# EAGLE schematic Spartan Edge Accelerator Board v1.0 (EAGLE 6.4)
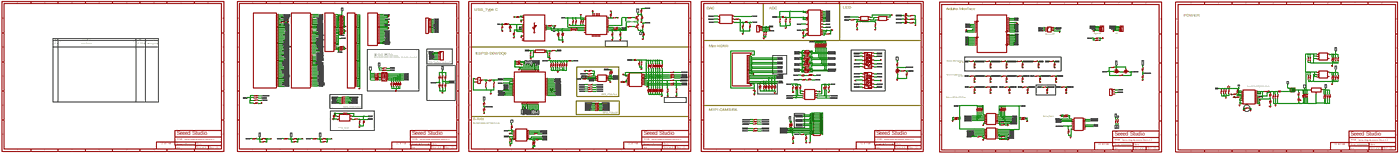
[diagram p0: schematic, sheet 1, overview]
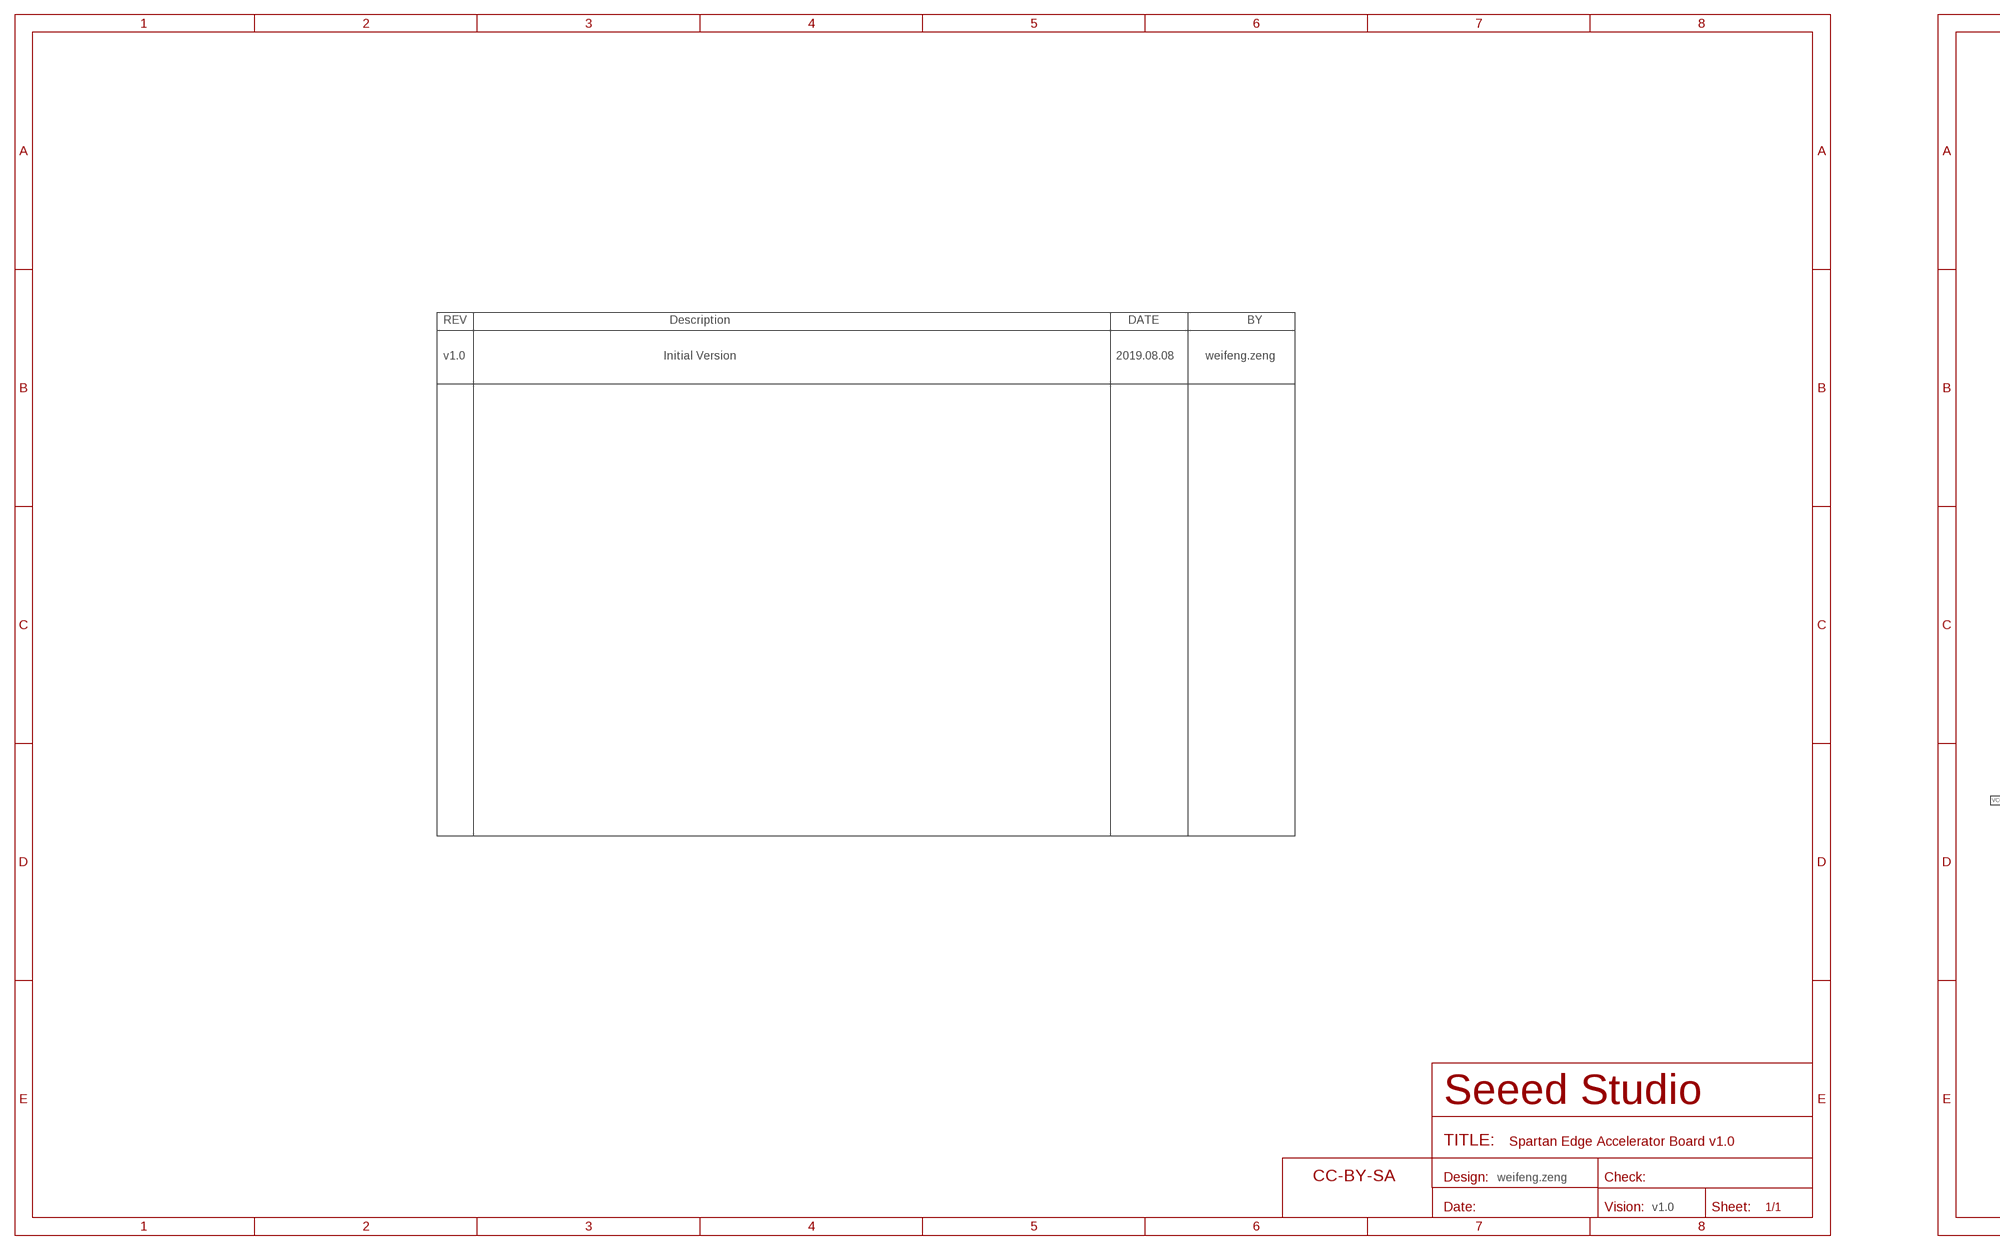
[diagram p1: schematic, sheet 1, part 1 of 7]
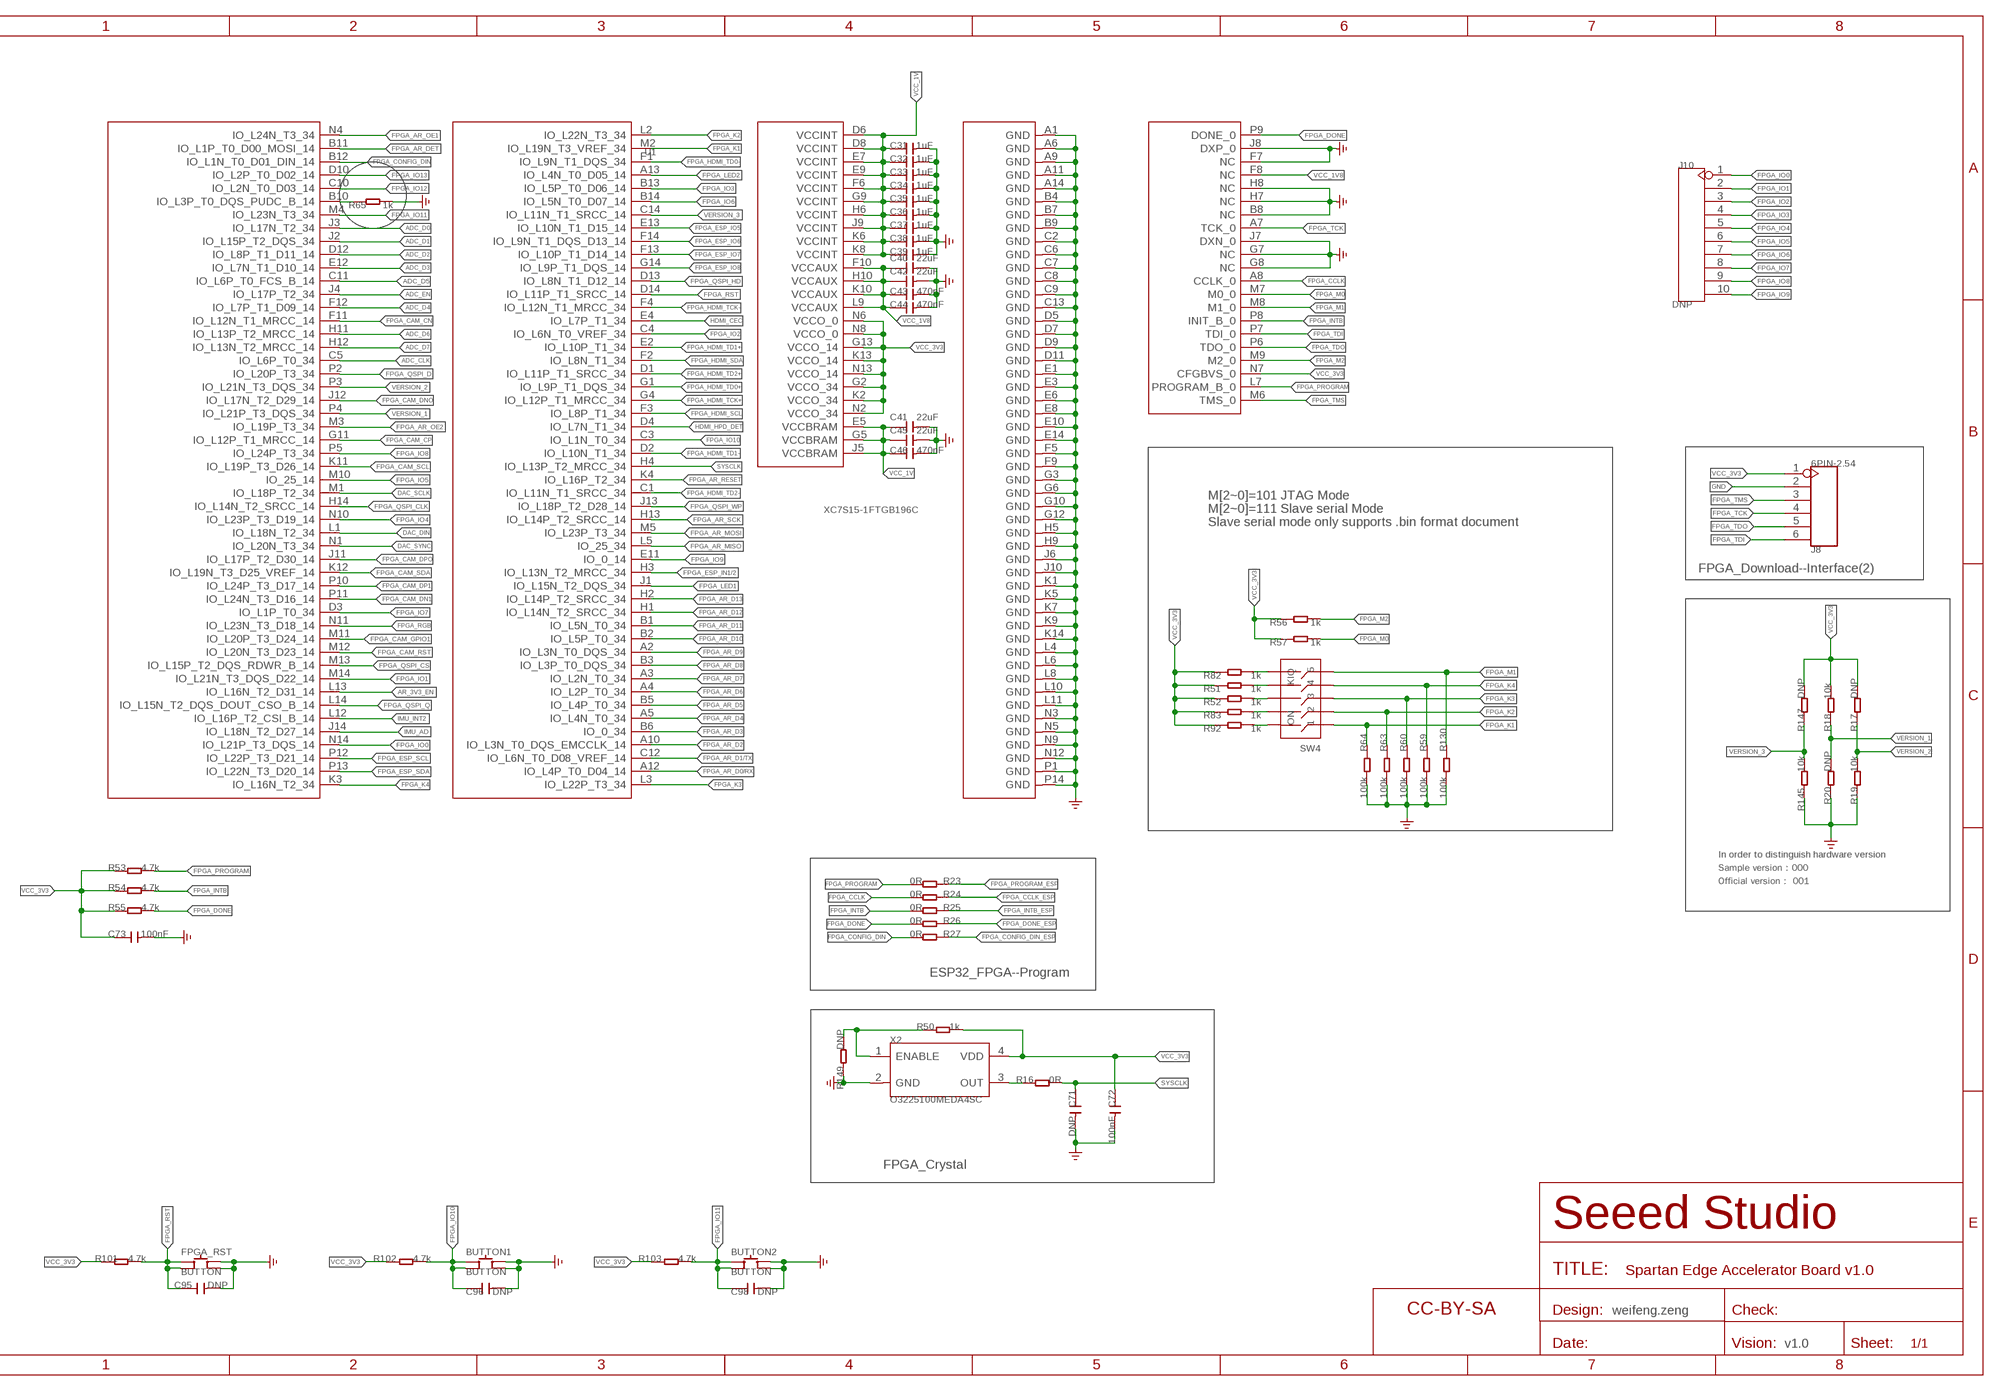
[diagram p2: schematic, sheet 1, part 2 of 7]
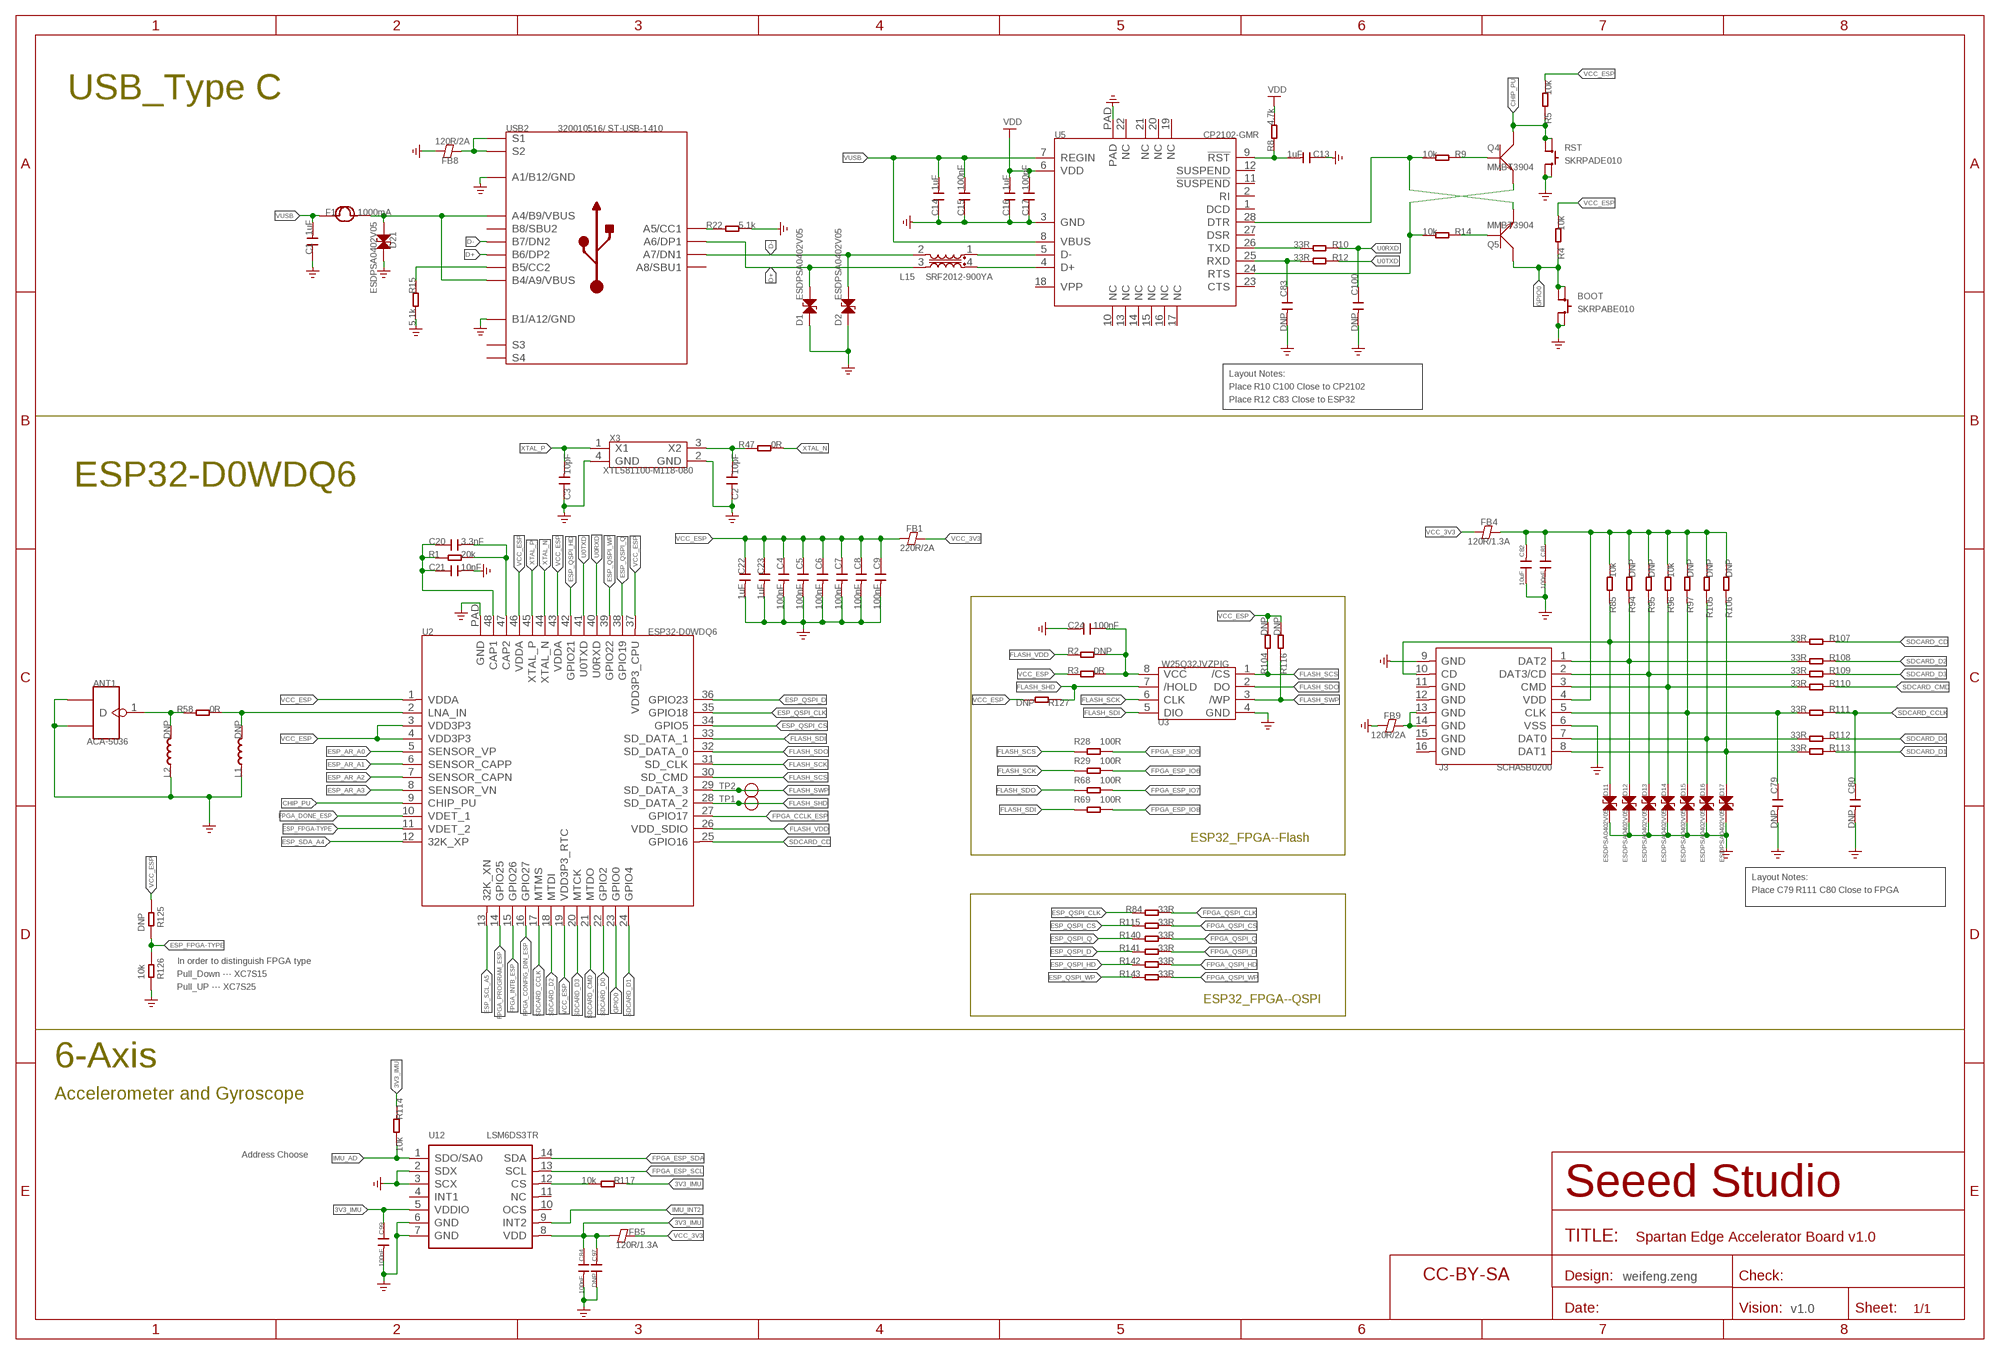
[diagram p3: schematic, sheet 1, part 3 of 7]
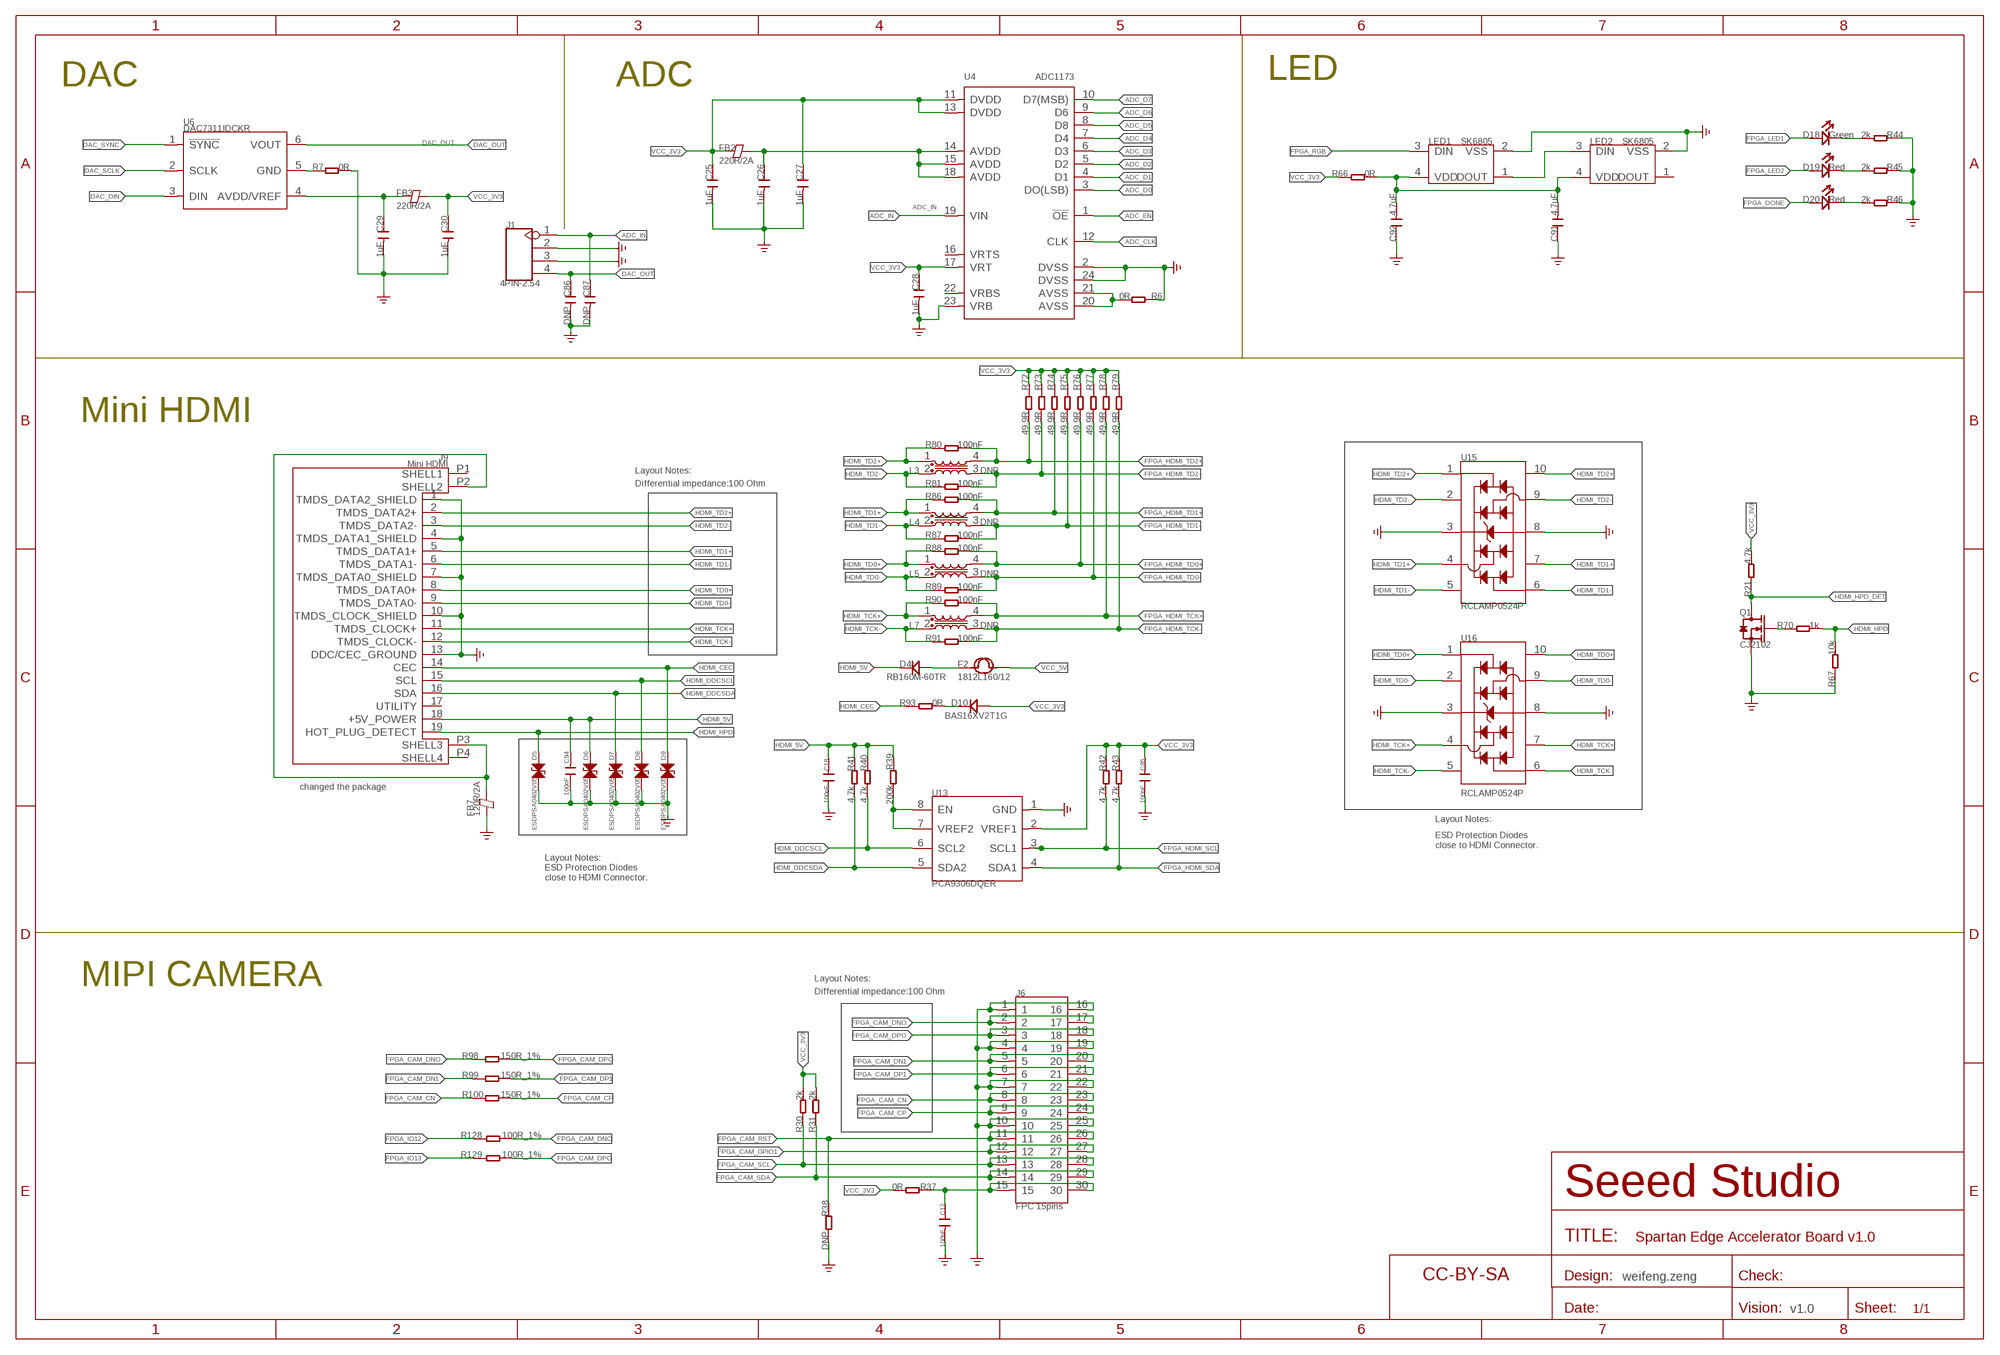
[diagram p4: schematic, sheet 1, part 4 of 7]
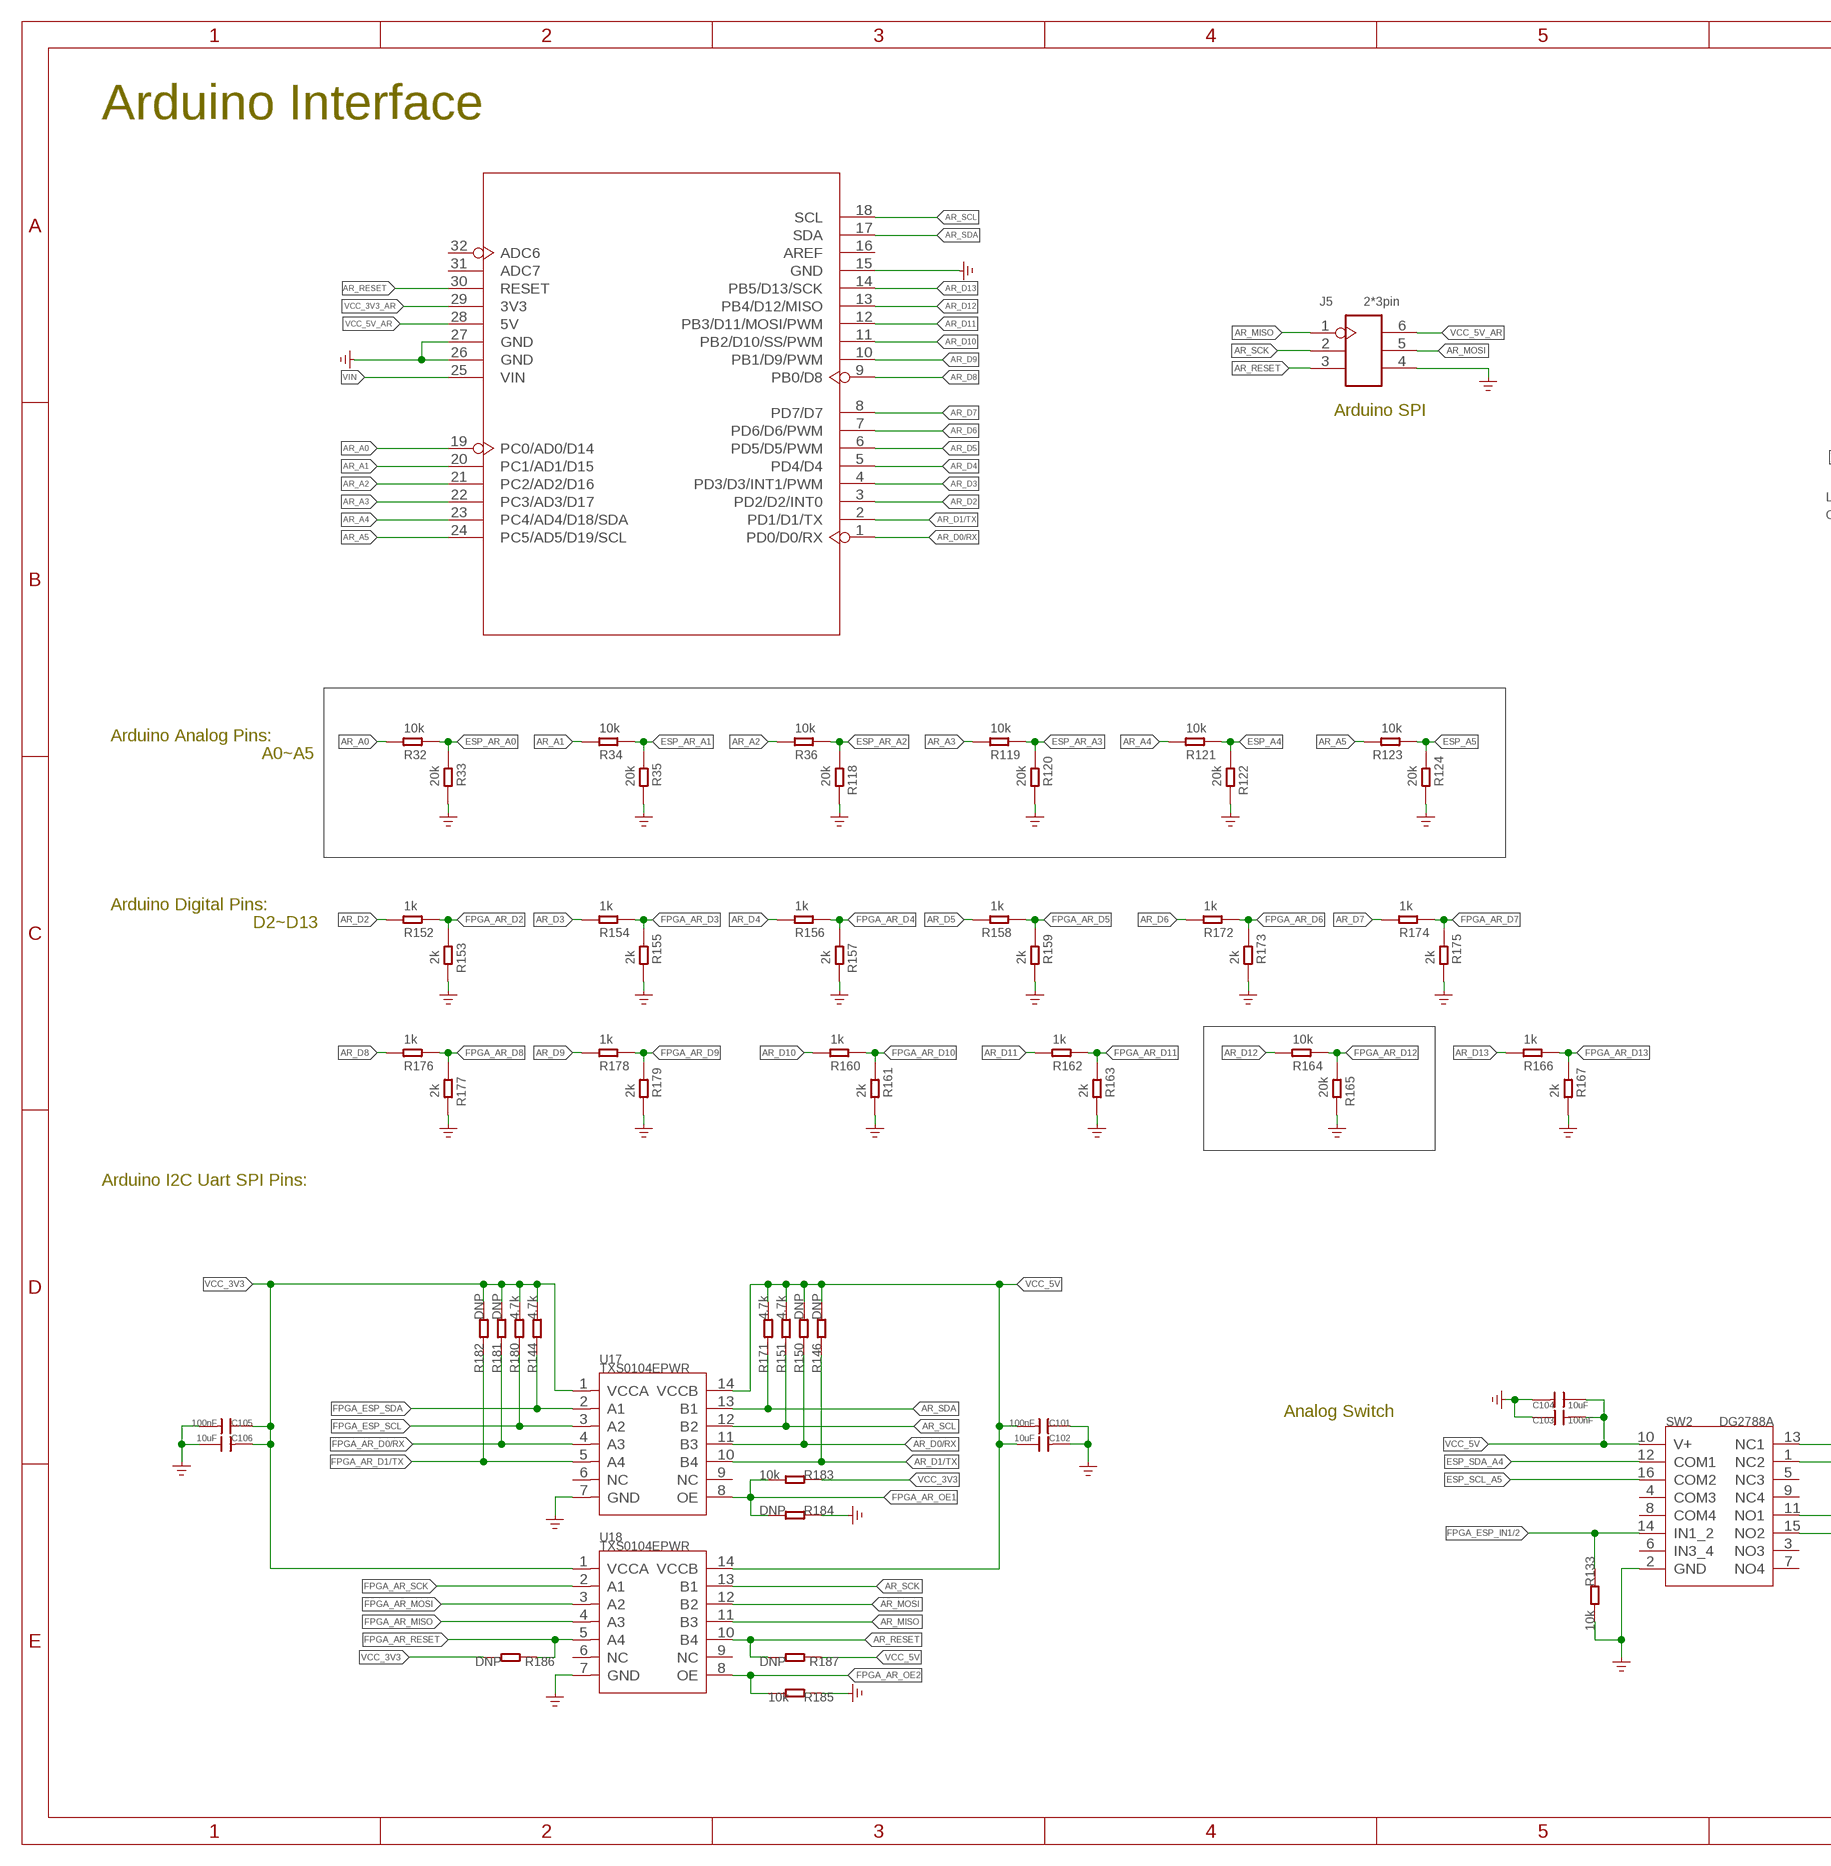
[diagram p5: schematic, sheet 1, part 5 of 7]
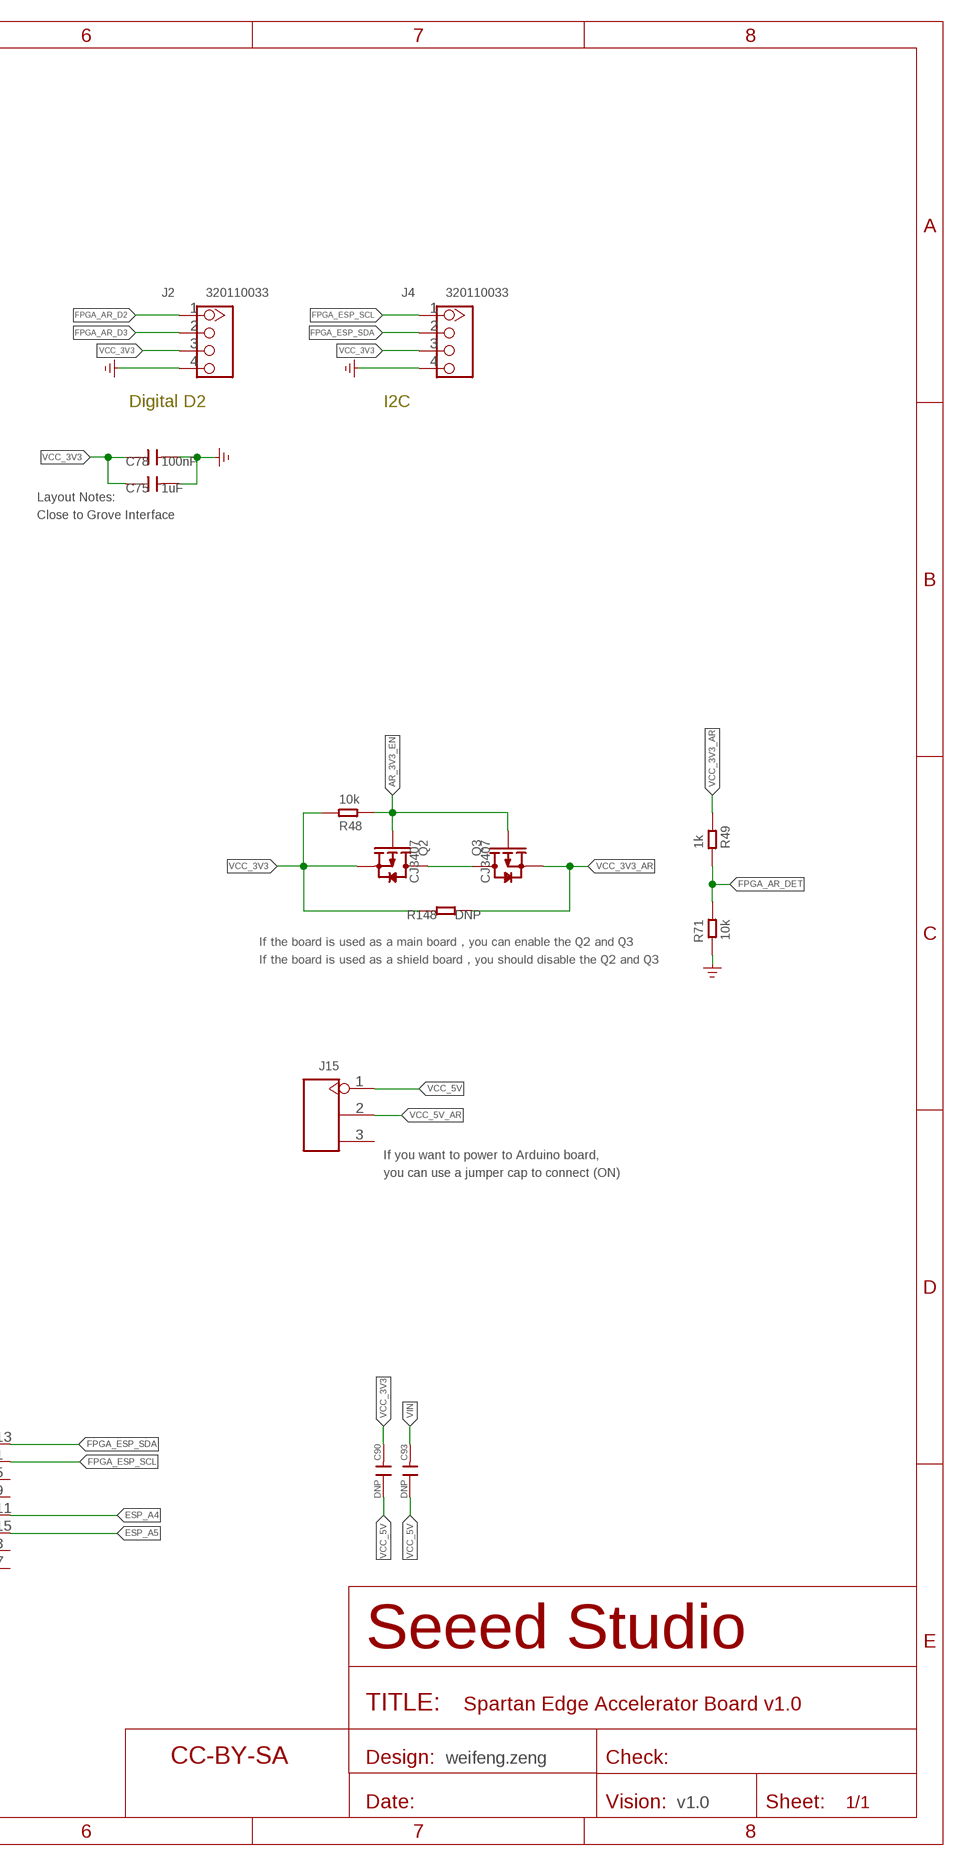
[diagram p6: schematic, sheet 1, part 6 of 7]
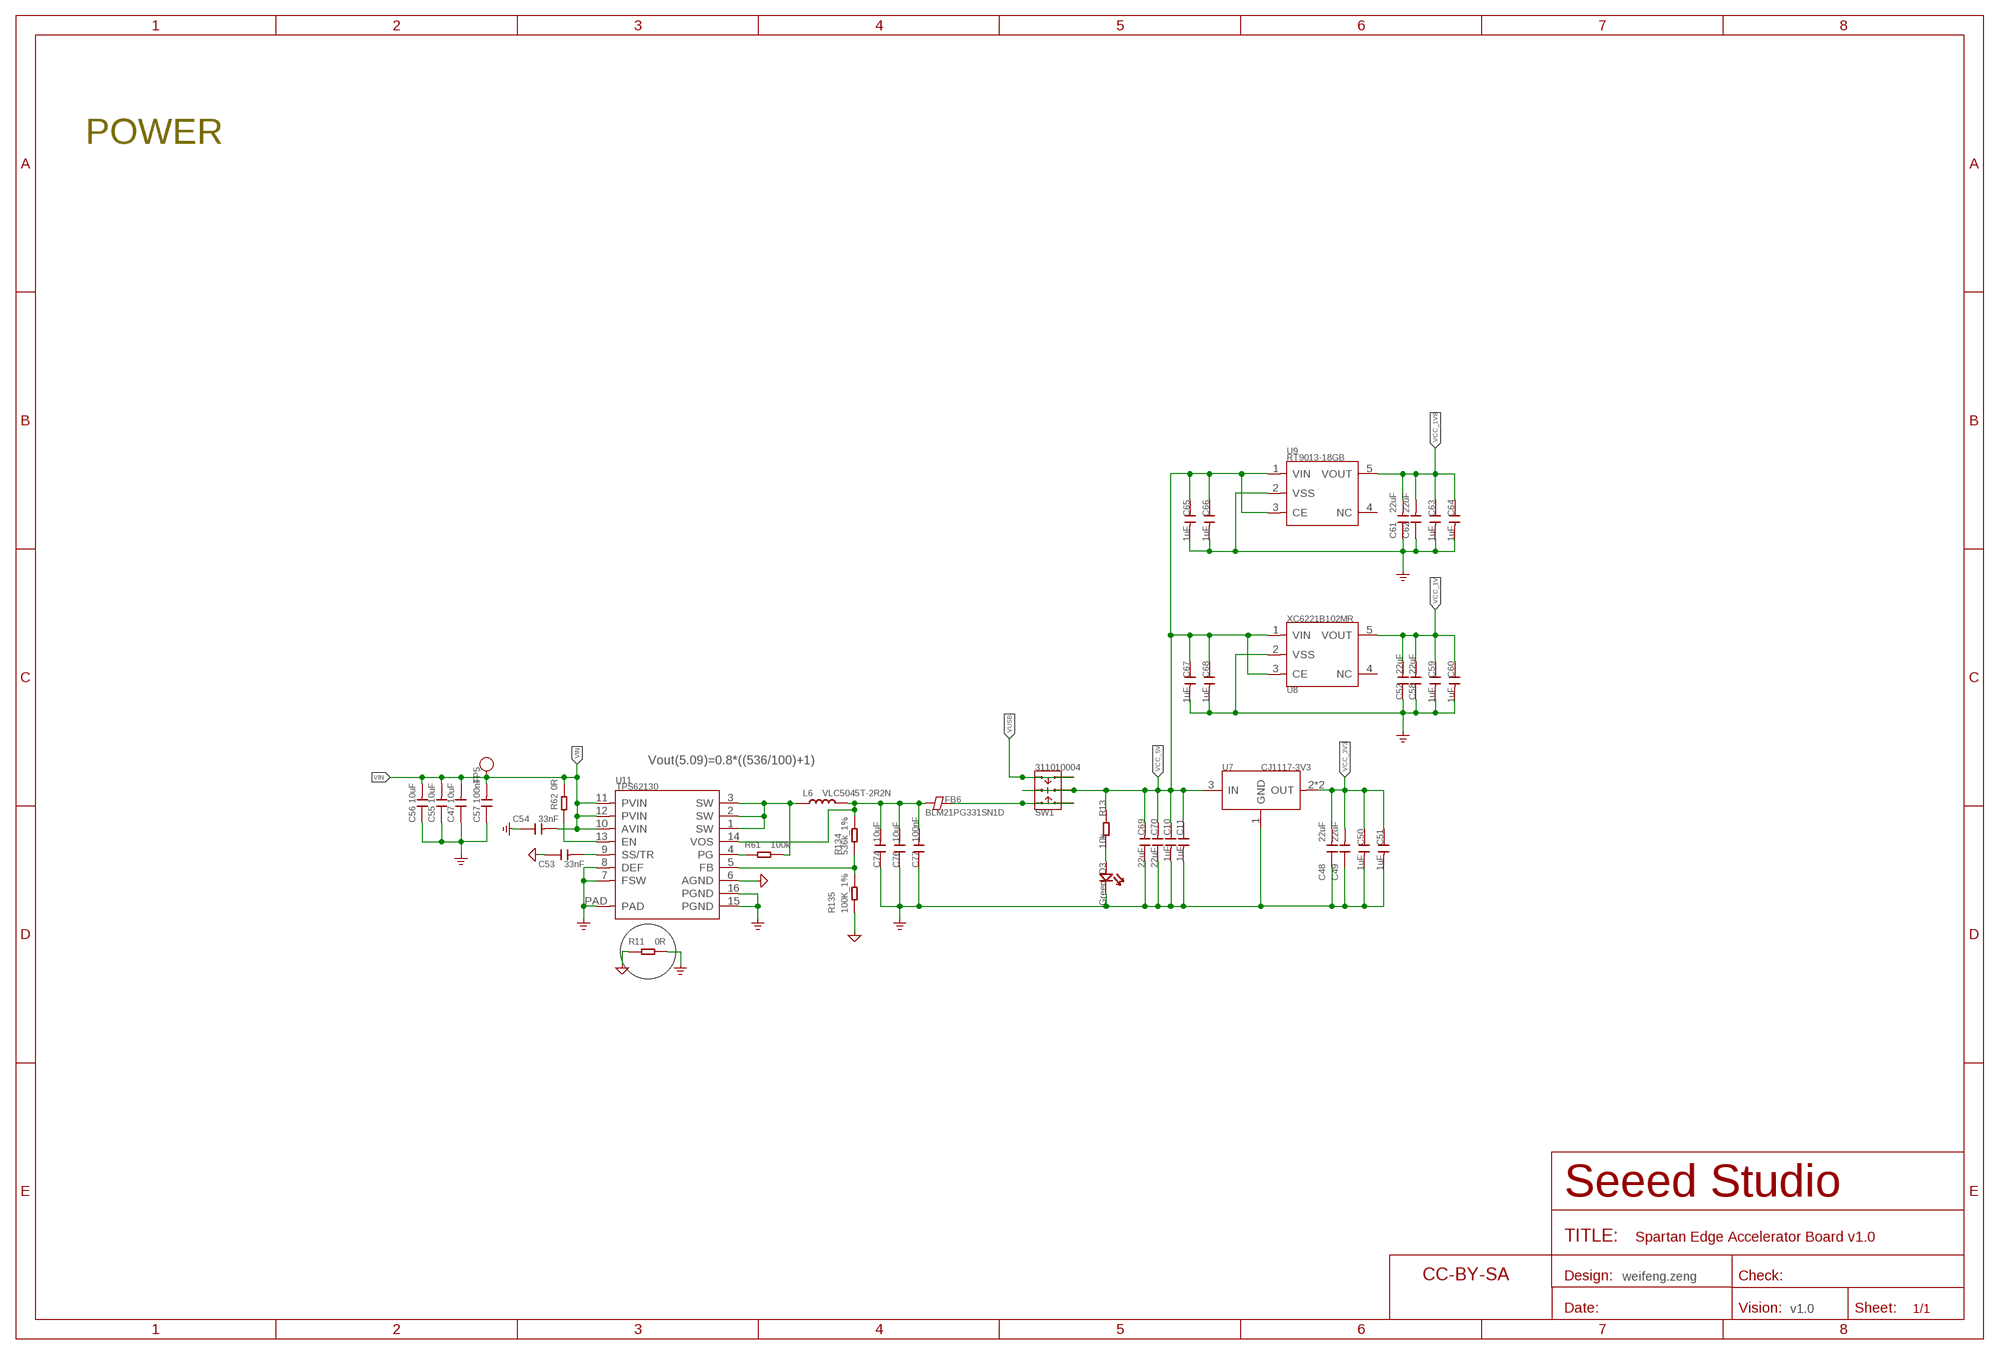
[diagram p7: schematic, sheet 1, part 7 of 7]

## Parts
ANT1  ACA-5036  ANTENNA-ACD5036  [ANT3-SMD-5.2X3.7X0.7MM]
BOOT  SKRPABE010  BUTTON-4P-4.5X3.2  [SW4P-SMD-4.5X3.2X2.5MM]
BUTTON1  BUTTON  BUTTON-4P-4.5X3.2  [SW4P-SMD-4.5X3.2X2.5MM]
BUTTON2  BUTTON  BUTTON-4P-4.5X3.2  [SW4P-SMD-4.5X3.2X2.5MM]
C1  1uF  CAP-0402  [C0402]
C2  10pF  CAP-0402  [C0402]
C3  10pF  CAP-0402  [C0402]
C4  100nF  CAP-0402  [C0402]
C5  100nF  CAP-0402  [C0402]
C6  100nF  CAP-0402  [C0402]
C7  100nF  CAP-0402  [C0402]
C8  100nF  CAP-0402  [C0402]
C9  100nF  CAP-0402  [C0402]
C10  1uF  CAP-0402  [C0402]
C11  1uF  CAP-0402  [C0402]
C12  100nF  CAP-0402  [C0402]
C13  1uF  CAP-0402  [C0402]
C14  1uF  CAP-0402  [C0402]
C15  100nF  CAP-0402  [C0402]
C16  1uF  CAP-0402  [C0402]
C17  100nF  CAP-0402  [C0402]
C18  100nF  CAP-0603  [C0603]
C20  3.3nF  CAP-0402  [C0402]
C21  10nF  CAP-0402  [C0402]
C22  1uF  CAP-0402  [C0402]
C23  1uF  CAP-0402  [C0402]
C24  100nF  CAP-0402  [C0402]
C25  1uF  CAP-0402  [C0402]
C26  1uF  CAP-0402  [C0402]
C27  1uF  CAP-0402  [C0402]
C28  1uF  CAP-0402  [C0402]
C29  1uF  CAP-0402  [C0402]
C30  1uF  CAP-0402  [C0402]
C31  1uF  CAP-0402  [C0402]
C32  1uF  CAP-0402  [C0402]
C33  1uF  CAP-0402  [C0402]
C34  1uF  CAP-0402  [C0402]
C35  1uF  CAP-0402  [C0402]
C36  1uF  CAP-0402  [C0402]
C37  1uF  CAP-0402  [C0402]
C38  1uF  CAP-0402  [C0402]
C39  1uF  CAP-0402  [C0402]
C40  22uF  CAP-1206  [C1206]
C41  22uF  CAP-1206  [C1206]
C42  22uF  CAP-1206  [C1206]
C43  470nF  CAP-0402  [C0402]
C44  470nF  CAP-0402  [C0402]
C45  22uF  CAP-1206  [C1206]
C46  470nF  CAP-0402  [C0402]
C47  10uF  CAP-0805  [C0805]
C48  22uF  CAP-1206  [C1206]
C49  22uF  CAP-1206  [C1206]
C50  1uF  CAP-0402  [C0402]
C51  1uF  CAP-0402  [C0402]
C52  22uF  CAP-1206  [C1206]
C53  33nF  CAP-0603  [C0603]
C54  33nF  CAP-0603  [C0603]
C55  10uF  CAP-0805  [C0805]
C56  10uF  CAP-0805  [C0805]
C57  100nF  CAP-0603  [C0603]
C58  22uF  CAP-1206  [C1206]
C59  1uF  CAP-0402  [C0402]
C60  1uF  CAP-0402  [C0402]
C61  22uF  CAP-1206  [C1206]
C62  22uF  CAP-1206  [C1206]
C63  1uF  CAP-0402  [C0402]
C64  1uF  CAP-0402  [C0402]
C65  1uF  CAP-0402  [C0402]
C66  1uF  CAP-0402  [C0402]
C67  1uF  CAP-0402  [C0402]
C68  1uF  CAP-0402  [C0402]
C69  22uF  CAP-1206  [C1206]
C70  22uF  CAP-1206  [C1206]
C71  DNP  CAP-0402  [C0402]
C72  100nF  CAP-0402  [C0402]
C73  100nF  CAP-0402  [C0402]
C74  10uF  CAP-0805  [C0805]
C75  1uF  CAP-0402  [C0402]
C76  10uF  CAP-0805  [C0805]
C77  100nF  CAP-0603  [C0603]
C78  100nF  CAP-0402  [C0402]
C79  DNP  CAP-0402  [C0402]
C80  DNP  CAP-0402  [C0402]
C81  100nF  CAP-0402  [C0402]
C82  10uF  CAP-0603  [C0603]
C83  DNP  CAP-0402  [C0402]
C84  100nF  CAP-0402  [C0402]
C85  100nF  CAP-0603  [C0603]
C86  DNP  CAP-0402  [C0402]
C87  DNP  CAP-0402  [C0402]
C90  DNP  CAP-0603  [C0603]
C91  4.7uF  CAP-0603  [C0603]
C92  4.7uF  CAP-0603  [C0603]
C93  DNP  CAP-0603  [C0603]
C94  100nF  CAP-0603  [C0603]
C95  DNP  CAP-0402  [C0402]
C96  DNP  CAP-0402  [C0402]
C97  DNP  CAP-0603  [C0603]
C98  DNP  CAP-0402  [C0402]
C99  100nF  CAP-0402  [C0402]
C100  DNP  CAP-0402  [C0402]
C101  100nF  CAP-0402  [C0402]
C102  10uF  CAP-0603  [C0603]
C103  100nF  CAP-0402  [C0402]
C104  10uF  CAP-0603  [C0603]
C105  100nF  CAP-0402  [C0402]
C106  10uF  CAP-0603  [C0603]
D1  ESDPSA0402V05  D-ESD-2P-DOUBLE-0402  [ESD-0402]
D2  ESDPSA0402V05  D-ESD-2P-DOUBLE-0402  [ESD-0402]
D3  Green  LED-0402  [LED-0402]
D4  RB160M-60TR  DIODE'1206'  [SOD-123]
D5  ESDPSA0402V05  D-ESD-2P-DOUBLE-0402  [ESD-0402]
D6  ESDPSA0402V05  D-ESD-2P-DOUBLE-0402  [ESD-0402]
D7  ESDPSA0402V05  D-ESD-2P-DOUBLE-0402  [ESD-0402]
D8  ESDPSA0402V05  D-ESD-2P-DOUBLE-0402  [ESD-0402]
D9  ESDPSA0402V05  D-ESD-2P-DOUBLE-0402  [ESD-0402]
D10  BAS16XV2T1G  DIODE'0603'  [SOD-523]
D11  ESDPSA0402V05  D-ESD-2P-DOUBLE-0402  [ESD-0402]
D12  ESDPSA0402V05  D-ESD-2P-DOUBLE-0402  [ESD-0402]
D13  ESDPSA0402V05  D-ESD-2P-DOUBLE-0402  [ESD-0402]
D14  ESDPSA0402V05  D-ESD-2P-DOUBLE-0402  [ESD-0402]
D15  ESDPSA0402V05  D-ESD-2P-DOUBLE-0402  [ESD-0402]
D16  ESDPSA0402V05  D-ESD-2P-DOUBLE-0402  [ESD-0402]
D17  ESDPSA0402V05  D-ESD-2P-DOUBLE-0402  [ESD-0402]
D18  Green  LED-0402  [LED-0402]
D19  Red  LED-0402  [LED-0402]
D20  Red  LED-0402  [LED-0402]
D21  ESDPSA0402V05  D-ESD-2P-DOUBLE-0402  [ESD-0402]
F1  1000mA  FUSE'1206'  [F1206]
F2  1812L160/12  FUSE'1812'  [F1812]
FB1  220R/2A  FERRITE-BEAD-0603  [F0603]
FB2  220R/2A  FERRITE-BEAD-0603  [F0603]
FB3  220R/2A  FERRITE-BEAD-0603  [F0603]
FB4  120R/1.3A  FERRITE-BEAD-0402  [F0402]
FB5  120R/1.3A  FERRITE-BEAD-0402  [F0402]
FB6  BLM21PG331SN1D  FERRITE-BEAD-0805  [F0805]
FB7  120R/2A  FERRITE-BEAD-0603  [F0603]
FB8  120R/2A  FERRITE-BEAD-0603  [F0603]
FB9  120R/2A  FERRITE-BEAD-0603  [F0603]
FPGA_RST  BUTTON  BUTTON-4P-4.5X3.2  [SW4P-SMD-4.5X3.2X2.5MM]
FR1  SEEEDSTUDIO-OPEN-SCH-FRAME-BIG  [SEEEDSTUDIO-PCB-FRAME]
FR2  SEEEDSTUDIO-OPEN-SCH-FRAME-BIG  [SEEEDSTUDIO-PCB-FRAME]
FR3  SEEEDSTUDIO-OPEN-SCH-FRAME-BIG  [SEEEDSTUDIO-PCB-FRAME]
FR4  SEEEDSTUDIO-OPEN-SCH-FRAME-BIG  [SEEEDSTUDIO-PCB-FRAME]
FR5  SEEEDSTUDIO-OPEN-SCH-FRAME-BIG  [SEEEDSTUDIO-PCB-FRAME]
FR6  SEEEDSTUDIO-OPEN-SCH-FRAME-BIG  [SEEEDSTUDIO-PCB-FRAME]
J1  4PIN-2.54  HEADER-4P-65/35MIL  [H4-2.54]
J2  320110033  GROVE-CONNECTOR-DIP-320110033  [HW4-2.0]
J3  SCHA5B0200  MICRO-SD-CARD-HOLDER-9P-SCHA5B0200-SCHA5B0200  [MICRO-SD9+7P-SMD-15X14.5X1.5]
J4  320110033  GROVE-CONNECTOR-DIP-320110033  [HW4-2.0]
J5  2*3pin  HEADER-2X3P-2.54  [H2X3-2.54]
J6  FPC 15pins  HEADER-2X15P-SMD  [H2X15-SMD-1MM]
J8  6PIN-2.54  HEADER-6P-65/35MIL  [H6-2.54-C65D35MIL]
J9  Mini HDMI  MINI-HDMI-19PIN-SMT-C-TYPE-ST-HD-002B  [HDMI-19+4P-0.4-11.2X7.5MM]
J10  DNP  HEADER-10P-2.54  [H10-2.54]
J15  HEADER-3P-2.54  [H3-2.54]
L1  DNP  INDUCTOR'0402'  [L0402]
L2  DNP  INDUCTOR'0402'  [L0402]
L3  DNP  INDUCTOR-COMMON-MODE-WCM-HDMI  [INT4-0.8-2X1.2MM]
L4  DNP  INDUCTOR-COMMON-MODE-WCM-HDMI  [INT4-0.8-2X1.2MM]
L5  DNP  INDUCTOR-COMMON-MODE-WCM-HDMI  [INT4-0.8-2X1.2MM]
L6  VLC5045T-2R2N  INDUCTOR-4.8X4.8  [INT2-SMD-4.8X4.8X3MM]
L7  DNP  INDUCTOR-COMMON-MODE-WCM-HDMI  [INT4-0.8-2X1.2MM]
L15  SRF2012-900YA  INDUCTOR-COMMON-MODE-SRF2012-900YA  [INT4-0.85-2X1.25X1.2MM]
LED1  SK6805  LED-SK6805-2427  [LED-4P-SMD-2.7X2.4MM]
LED2  SK6805  LED-SK6805-2427  [LED-4P-SMD-2.7X2.4MM]
Q1  CJ2102  MOSFET-N'SI1304BDL'  [SOT-323]
Q2  CJ3407  MOSFET-P'SI2323CDS/SI2305DS<BR>'  [SOT-23]
Q3  CJ3407  MOSFET-P'SI2323CDS/SI2305DS<BR>'  [SOT-23]
Q4  MMBT3904  TRANSISTOR-NPN-SOT23  [SOT-23]
Q5  MMBT3904  TRANSISTOR-NPN-SOT23  [SOT-23]
R1  20k  RES-0402  [R0402]
R2  DNP  RES-0402  [R0402]
R3  0R  RES-0402  [R0402]
R4  10k  RES-0402  [R0402]
R5  10k  RES-0402  [R0402]
R6  0R  RES-0402  [R0402]
R7  0R  RES-0402  [R0402]
R8  4.7k  RES-0402  [R0402]
R9  10k  RES-0402  [R0402]
R10  33R  RES-0402  [R0402]
R11  0R  RES-0603  [R0603]
R12  33R  RES-0402  [R0402]
R13  10k  RES-0402  [R0402]
R14  10k  RES-0402  [R0402]
R15  5.1k  RES-0402  [R0402]
R16  0R  RES-0402  [R0402]
R17  DNP  RES-0402  [R0402]
R18  10k  RES-0402  [R0402]
R19  10k  RES-0402  [R0402]
R20  DNP  RES-0402  [R0402]
R21  4.7k  RES-0402  [R0402]
R22  5.1k  RES-0402  [R0402]
R23  0R  RES-0402  [R0402]
R24  0R  RES-0402  [R0402]
R25  0R  RES-0402  [R0402]
R26  0R  RES-0402  [R0402]
R27  0R  RES-0402  [R0402]
R28  100R  RES-0402  [R0402]
R29  100R  RES-0402  [R0402]
R30  2k  RES-0402  [R0402]
R31  2k  RES-0402  [R0402]
R32  10k  RES-0402  [R0402]
R33  20k  RES-0402  [R0402]
R34  10k  RES-0402  [R0402]
R35  20k  RES-0402  [R0402]
R36  10k  RES-0402  [R0402]
R37  0R  RES-0402  [R0402]
R38  DNP  RES-0402  [R0402]
R39  200k  RES-0402  [R0402]
R40  4.7k  RES-0402  [R0402]
R41  4.7k  RES-0402  [R0402]
R42  4.7k  RES-0402  [R0402]
R43  4.7k  RES-0402  [R0402]
R44  2k  RES-0402  [R0402]
R45  2k  RES-0402  [R0402]
R46  2k  RES-0402  [R0402]
R47  0R  RES-0402  [R0402]
R48  10k  RES-0402  [R0402]
R49  1k  RES-0402  [R0402]
R50  1k  RES-0402  [R0402]
R51  1k  RES-0402  [R0402]
R52  1k  RES-0402  [R0402]
R53  4.7k  RES-0402  [R0402]
R54  4.7k  RES-0402  [R0402]
R55  4.7k  RES-0402  [R0402]
R56  1k  RES-0402  [R0402]
R57  1k  RES-0402  [R0402]
R58  0R  RES-0402  [R0402]
R59  100k  RES-0402  [R0402]
R60  100k  RES-0402  [R0402]
R61  100k  RES-0603  [R0603]
R62  0R  RES-0603  [R0603]
R63  100k  RES-0402  [R0402]
R64  100k  RES-0402  [R0402]
R65  1k  RES-0402  [R0402]
R66  0R  RES-0402  [R0402]
R67  10k  RES-0402  [R0402]
R68  100R  RES-0402  [R0402]
R69  100R  RES-0402  [R0402]
R70  1k  RES-0402  [R0402]
R71  10k  RES-0402  [R0402]
R72  49.9R  RES-0402  [R0402]
R73  49.9R  RES-0402  [R0402]
R74  49.9R  RES-0402  [R0402]
R75  49.9R  RES-0402  [R0402]
R76  49.9R  RES-0402  [R0402]
R77  49.9R  RES-0402  [R0402]
R78  49.9R  RES-0402  [R0402]
R79  49.9R  RES-0402  [R0402]
R80  100nF  RES-0603  [R0603]
R81  100nF  RES-0603  [R0603]
R82  1k  RES-0402  [R0402]
R83  1k  RES-0402  [R0402]
R84  33R  RES-0402  [R0402]
R85  10k  RES-0402  [R0402]
R86  100nF  RES-0603  [R0603]
R87  100nF  RES-0603  [R0603]
R88  100nF  RES-0603  [R0603]
R89  100nF  RES-0603  [R0603]
R90  100nF  RES-0603  [R0603]
R91  100nF  RES-0603  [R0603]
R92  1k  RES-0402  [R0402]
R93  0R  RES-0402  [R0402]
R94  DNP  RES-0402  [R0402]
R95  DNP  RES-0402  [R0402]
R96  10k  RES-0402  [R0402]
R97  DNP  RES-0402  [R0402]
R98  150R_1%  RES-0402  [R0402]
R99  150R_1%  RES-0402  [R0402]
R100  150R_1%  RES-0402  [R0402]
R101  4.7k  RES-0402  [R0402]
R102  4.7k  RES-0402  [R0402]
R103  4.7k  RES-0402  [R0402]
R104  DNP  RES-0402  [R0402]
R105  DNP  RES-0402  [R0402]
R106  DNP  RES-0402  [R0402]
R107  33R  RES-0402  [R0402]
R108  33R  RES-0402  [R0402]
R109  33R  RES-0402  [R0402]
R110  33R  RES-0402  [R0402]
R111  33R  RES-0402  [R0402]
R112  33R  RES-0402  [R0402]
R113  33R  RES-0402  [R0402]
R114  10k  RES-0402  [R0402]
R115  33R  RES-0402  [R0402]
R116  DNP  RES-0402  [R0402]
R117  10k  RES-0402  [R0402]
R118  20k  RES-0402  [R0402]
R119  10k  RES-0402  [R0402]
R120  20k  RES-0402  [R0402]
R121  10k  RES-0402  [R0402]
R122  20k  RES-0402  [R0402]
R123  10k  RES-0402  [R0402]
R124  20k  RES-0402  [R0402]
R125  DNP  RES-0402  [R0402]
R126  10k  RES-0402  [R0402]
R127  DNP  RES-0402  [R0402]
R128  100R_1%  RES-0402  [R0402]
R129  100R_1%  RES-0402  [R0402]
R130  100k  RES-0402  [R0402]
R133  10k  RES-0402  [R0402]
R134  536k_1%  RES-0603  [R0603]
R135  100K_1%  RES-0603  [R0603]
R140  33R  RES-0402  [R0402]
R141  33R  RES-0402  [R0402]
R142  33R  RES-0402  [R0402]
R143  33R  RES-0402  [R0402]
R144  4.7k  RES-0402  [R0402]
R145  10k  RES-0402  [R0402]
R146  DNP  RES-0402  [R0402]
R147  DNP  RES-0402  [R0402]
R148  DNP  RES-1206  [R1206]
R149  DNP  RES-0402  [R0402]
R150  DNP  RES-0402  [R0402]
R151  4.7k  RES-0402  [R0402]
R152  1k  RES-0402  [R0402]
R153  2k  RES-0402  [R0402]
R154  1k  RES-0402  [R0402]
R155  2k  RES-0402  [R0402]
R156  1k  RES-0402  [R0402]
R157  2k  RES-0402  [R0402]
R158  1k  RES-0402  [R0402]
R159  2k  RES-0402  [R0402]
R160  1k  RES-0402  [R0402]
R161  2k  RES-0402  [R0402]
R162  1k  RES-0402  [R0402]
R163  2k  RES-0402  [R0402]
R164  10k  RES-0402  [R0402]
R165  20k  RES-0402  [R0402]
R166  1k  RES-0402  [R0402]
R167  2k  RES-0402  [R0402]
R171  4.7k  RES-0402  [R0402]
R172  1k  RES-0402  [R0402]
R173  2k  RES-0402  [R0402]
R174  1k  RES-0402  [R0402]
R175  2k  RES-0402  [R0402]
R176  1k  RES-0402  [R0402]
R177  2k  RES-0402  [R0402]
R178  1k  RES-0402  [R0402]
R179  2k  RES-0402  [R0402]
R180  4.7k  RES-0402  [R0402]
R181  DNP  RES-0402  [R0402]
R182  DNP  RES-0402  [R0402]
R183  10k  RES-0402  [R0402]
R184  DNP  RES-0402  [R0402]
R185  10k  RES-0402  [R0402]
R186  DNP  RES-0402  [R0402]
R187  DNP  RES-0402  [R0402]
RST  SKRPADE010  BUTTON-4P-4.5X3.2  [SW4P-SMD-4.5X3.2X2.5MM]
SW1  311010004  SWITCH-2CH-6P-311010004  [SW6-2.54-9.0X3.5X3.2+2.0MM]
SW2  DG2788A  SWITCH-DG2788A  [MINI-QFN16-0.4-2.6X1.8X0.55MM]
SW4  SWITCH-5BIT-DSHP05TSGER  [10P-SMD-7.95X5.4X2.3MM]
TP1  TEST-POINT-35  [TP_3535]
TP2  TEST-POINT-35  [TP_3535]
TP5  TEST-POINT'4545'  [TP-D45MIL]
U1  XC7S15-1FTGB196C  XC7S15  [FTGB196-1.0-15X15X1.46MM]
U2  ESP32-D0WDQ6  MCU-ESP32-DD0WDQ6  [QFN48G-0.4-6X6MM]
U3  W25Q32JVZPIG  FLASH-W25X80-5X4-SN  [SOIC8-1.27-5X4MM]
U4  ADC1173  CONVERTER-ADC1173  [TSSOP24-0.65-7.8X4.4MM]
U5  CP2102-GMR  TRANSFER_CP2102_9  [QFN28]
U6  DAC7311IDCKR  CONVERTER-DAC7311  [SC-70-6]
U7  CJ1117-3V3  PMIC-CJ1117S  [SOT-223]
U8  XC6221B102MR  PMIC-LDO-XC6210  [SOT-23-5]
U9  RT9013-18GB  PMIC-LDO-XC6210  [SOT-23-5]
U10  Arduino pins  ARDUINO-32P  [ARDUINO-32P]
U11  TPS62130  PMIC-TPS62140  [VQFN16-0.5-3X3X1MM]
U12  LSM6DS3TR  SENSOR-LSM6DS3DOT_INDICATION  [LGA14L_DOT_INDICATOR]
U13  PCA9306DQER  TRANSLATOR-PCA9306DQER  [X2SON8-0.35-1.4X1X0.37MM]
U15  RCLAMP0524P  ESD-RCLAMP0524P  [ESD10P-0.5-2.5X1X0.58MM]
U16  RCLAMP0524P  ESD-RCLAMP0524P  [ESD10P-0.5-2.5X1X0.58MM]
U17  TXS0104EPWR  TRANSLATOR-TXS0104E  [TSSOP14-0.65-5X4.4MM]
U18  TXS0104EPWR  TRANSLATOR-TXS0104E  [TSSOP14-0.65-5X4.4MM]
USB2  320010516/ ST-USB-1410  USB2.0-TYPE-C  [USB2.0-TYPE-C]
X2  O3225100MEDA4SC  CRYSTAL-OSCILLATOR-3225  [X4-SMD-3.2X2.5X1MM]
X3  XTL581100-M118-080  CRYSTAL-4P-2520  [X4-SMD-2.5X2.0X1.0MM]

## Nets
3V3_IMU: C84.1 C97.2 C99.1 FB5.2 R114.2 R117.2 U12.5(VDDIO) U12.8(VDD)
ADC_CLK: U1.C5(IO_L6P_T0_34) U4.12(CLK)
ADC_D0: U1.J3(IO_L17N_T2_34) U4.3(DO(LSB))
ADC_D1: U1.J2(IO_L15P_T2_DQS_34) U4.4(D1)
ADC_D2: U1.D12(IO_L8P_T1_D11_14) U4.5(D2)
ADC_D3: U1.E12(IO_L7N_T1_D10_14) U4.6(D3)
ADC_D4: U1.F12(IO_L7P_T1_D09_14) U4.7(D4)
ADC_D5: U1.C11(IO_L6P_T0_FCS_B_14) U4.8(D8)
ADC_D6: U1.H11(IO_L13P_T2_MRCC_14) U4.9(D6)
ADC_D7: U1.H12(IO_L13N_T2_MRCC_14) U4.10(D7(MSB))
ADC_EN: U1.J4(IO_L17P_T2_34) U4.1(!OE)
ADC_IN: C87.1 J1.1 U4.19(VIN)
AGND: C53.1 R11.1 R135.2 U11.6(AGND) ; supply symbol labelled GND_SIGNAL
AR_3V3_EN: Q2.1(G) Q3.1(G) R48.1 U1.L13(IO_L16N_T2_D31_14)
AR_A0: R32.2 U10.19(PC0/AD0/D14)
AR_A1: R34.2 U10.20(PC1/AD1/D15)
AR_A2: R36.2 U10.21(PC2/AD2/D16)
AR_A3: R119.2 U10.22(PC3/AD3/D17)
AR_A4: R121.2 U10.23(PC4/AD4/D18/SDA)
AR_A5: R123.2 U10.24(PC5/AD5/D19/SCL)
AR_D0/RX: R150.1 U10.1(PD0/D0/RX) U17.11(B3)
AR_D1/TX: R146.1 U10.2(PD1/D1/TX) U17.10(B4)
AR_D2: R152.2 U10.3(PD2/D2/INT0)
AR_D3: R154.2 U10.4(PD3/D3/INT1/PWM)
AR_D4: R156.2 U10.5(PD4/D4)
AR_D5: R158.2 U10.6(PD5/D5/PWM)
AR_D6: R172.2 U10.7(PD6/D6/PWM)
AR_D7: R174.2 U10.8(PD7/D7)
AR_D8: R176.2 U10.9(PB0/D8)
AR_D9: R178.2 U10.10(PB1/D9/PWM)
AR_D10: R160.2 U10.11(PB2/D10/SS/PWM)
AR_D11: R162.2 U10.12(PB3/D11/MOSI/PWM)
AR_D12: R164.2 U10.13(PB4/D12/MISO)
AR_D13: R166.2 U10.14(PB5/D13/SCK)
AR_MISO: J5.1 U18.11(B3)
AR_MOSI: J5.5 U18.12(B2)
AR_RESET: J5.3 R187.2 U10.30(RESET) U18.10(B4)
AR_SCK: J5.2 U18.13(B1)
AR_SCL: R151.1 U10.18(SCL) U17.12(B2)
AR_SDA: R171.1 U10.17(SDA) U17.13(B1)
CHIP_PU: Q4.3(C) R5.1 RST.1(A0) RST.2(A1) U2.9(CHIP_PU)
D+: D1.2 L15.3 USB2.A6(A6/DP1) USB2.B6(B6/DP2)
D-: D2.2 L15.2 USB2.A7(A7/DN1) USB2.B7(B7/DN2)
DAC_DIN: U1.L1(IO_L18N_T2_34) U6.3(DIN)
DAC_OUT: C86.1 J1.4 U6.6(VOUT)
DAC_SCLK: U1.M1(IO_L18P_T2_34) U6.2(SCLK)
DAC_SYNC: U1.N1(IO_L20N_T3_34) U6.1(!SYNC)
ESP_A4: R121.1 R122.1 SW2.11(NO1)
ESP_A5: R123.1 R124.1 SW2.15(NO2)
ESP_AR_A0: R32.1 R33.1 U2.5(SENSOR_VP)
ESP_AR_A1: R34.1 R35.1 U2.6(SENSOR_CAPP)
ESP_AR_A2: R36.1 R118.1 U2.7(SENSOR_CAPN)
ESP_AR_A3: R119.1 R120.1 U2.8(SENSOR_VN)
ESP_FPGA-TYPE: R125.1 R126.2 U2.11(VDET_2)
ESP_QSPI_CLK: R84.2 U2.35(GPIO18)
ESP_QSPI_CS: R115.2 U2.34(GPIO5)
ESP_QSPI_D: R141.2 U2.36(GPIO23)
ESP_QSPI_HD: R142.2 U2.42(GPIO21)
ESP_QSPI_Q: R140.2 U2.38(GPIO19)
ESP_QSPI_WP: R143.2 U2.39(GPIO22)
ESP_SCL_A5: SW2.16(COM2) U2.13(32K_XN)
ESP_SDA_A4: SW2.12(COM1) U2.12(32K_XP)
FLASH_SCK: R29.2 U2.31(SD_CLK) U3.6(CLK)
FLASH_SCS: R28.2 R104.2 U2.30(SD_CMD) U3.1(/CS)
FLASH_SDI: R69.2 U2.33(SD_DATA_1) U3.5(DIO)
FLASH_SDO: R68.2 U2.32(SD_DATA_0) U3.2(DO)
FLASH_SHD: R127.2 TP1.T U2.28(SD_DATA_2) U3.7(/HOLD)
FLASH_SWP: R116.2 TP2.T U2.29(SD_DATA_3) U3.3(/WP)
FLASH_VDD: R2.2 U2.26(VDD_SDIO)
FPGA_AR_D0/RX: R181.1 U1.A12(IO_L4P_T0_D04_14) U17.4(A3)
FPGA_AR_D1/TX: R182.1 U1.C12(IO_L6N_T0_D08_VREF_14) U17.5(A4)
FPGA_AR_D2: J2.1 R152.1 R153.1 U1.A10(IO_L3N_T0_DQS_EMCCLK_14)
FPGA_AR_D3: J2.2 R154.1 R155.1 U1.B6(IO_0_34)
FPGA_AR_D4: R156.1 R157.1 U1.A5(IO_L4N_T0_34)
FPGA_AR_D5: R158.1 R159.1 U1.B5(IO_L4P_T0_34)
FPGA_AR_D6: R172.1 R173.1 U1.A4(IO_L2P_T0_34)
FPGA_AR_D7: R174.1 R175.1 U1.A3(IO_L2N_T0_34)
FPGA_AR_D8: R176.1 R177.1 U1.B3(IO_L3P_T0_DQS_34)
FPGA_AR_D9: R178.1 R179.1 U1.A2(IO_L3N_T0_DQS_34)
FPGA_AR_D10: R160.1 R161.1 U1.B2(IO_L5P_T0_34)
FPGA_AR_D11: R162.1 R163.1 U1.B1(IO_L5N_T0_34)
FPGA_AR_D12: R164.1 R165.1 U1.H1(IO_L14N_T2_SRCC_34)
FPGA_AR_D13: R166.1 R167.1 U1.H2(IO_L14P_T2_SRCC_34)
FPGA_AR_DET: R49.2 R71.2 U1.B11(IO_L1P_T0_D00_MOSI_14)
FPGA_AR_MISO: U1.L5(IO_25_34) U18.4(A3)
FPGA_AR_MOSI: U1.M5(IO_L23P_T3_34) U18.3(A2)
FPGA_AR_OE1: R183.2 R184.2 U1.N4(IO_L24N_T3_34) U17.8(OE)
FPGA_AR_OE2: R185.2 U1.M3(IO_L19P_T3_34) U18.8(OE)
FPGA_AR_RESET: R186.1 U1.K4(IO_L16P_T2_34) U18.5(A4)
FPGA_AR_SCK: U1.H13(IO_L14P_T2_SRCC_14) U18.2(A1)
FPGA_CAM_CN: J6.8 J6.23 R100.1 U1.F11(IO_L12N_T1_MRCC_14)
FPGA_CAM_CP: J6.9 J6.24 R100.2 U1.G11(IO_L12P_T1_MRCC_14)
FPGA_CAM_DN1: J6.5 J6.20 R99.1 U1.P11(IO_L24N_T3_D16_14)
FPGA_CAM_DNO: J6.2 J6.17 R98.1 R128.1 U1.J12(IO_L17N_T2_D29_14)
FPGA_CAM_DP1: J6.6 J6.21 R99.2 U1.P10(IO_L24P_T3_D17_14)
FPGA_CAM_DPO: J6.3 J6.18 R98.2 R129.1 U1.J11(IO_L17P_T2_D30_14)
FPGA_CAM_GPIO1: J6.12 J6.27 U1.M11(IO_L20P_T3_D24_14)
FPGA_CAM_RST: J6.11 J6.26 R38.1 U1.M12(IO_L20N_T3_D23_14)
FPGA_CAM_SCL: J6.13 J6.28 R30.1 U1.K11(IO_L19P_T3_D26_14)
FPGA_CAM_SDA: J6.14 J6.29 R31.1 U1.K12(IO_L19N_T3_D25_VREF_14)
FPGA_CCLK: R24.2 U1.A8(CCLK_0)
FPGA_CCLK_ESP: R24.1 U2.27(GPIO17)
FPGA_CONFIG_DIN: R27.2 U1.B12(IO_L1N_T0_D01_DIN_14)
FPGA_CONFIG_DIN_ESP: R27.1 U2.16(GPIO27)
FPGA_DONE: D20.+ R26.2 R55.2 U1.P9(DONE_0)
FPGA_DONE_ESP: R26.1 U2.10(VDET_1)
FPGA_ESP_IN1/2: R133.1 SW2.14(IN1_2) U1.H3(IO_L13N_T2_MRCC_34)
FPGA_ESP_IO5: R28.1 U1.E13(IO_L10N_T1_D15_14)
FPGA_ESP_IO6: R29.1 U1.F14(IO_L9N_T1_DQS_D13_14)
FPGA_ESP_IO7: R68.1 U1.F13(IO_L10P_T1_D14_14)
FPGA_ESP_IO8: R69.1 U1.G14(IO_L9P_T1_DQS_14)
FPGA_ESP_SCL: J4.1 R180.1 SW2.1(NC2) U1.P12(IO_L22P_T3_D21_14) U12.13(SCL) U17.3(A2)
FPGA_ESP_SDA: J4.2 R144.1 SW2.13(NC1) U1.P13(IO_L22N_T3_D20_14) U12.14(SDA) U17.2(A1)
FPGA_HDMI_SCL: R42.2 U1.F3(IO_L8P_T1_34) U13.3(SCL1)
FPGA_HDMI_SDA: R43.2 U1.F2(IO_L8N_T1_34) U13.4(SDA1)
FPGA_HDMI_TCK+: L7.4 R78.2 R90.2 U1.G4(IO_L12P_T1_MRCC_34)
FPGA_HDMI_TCK-: L7.3 R79.2 R91.2 U1.F4(IO_L12N_T1_MRCC_34)
FPGA_HDMI_TD0+: L5.4 R76.2 R88.2 U1.G1(IO_L9P_T1_DQS_34)
FPGA_HDMI_TD0-: L5.3 R77.2 R89.2 U1.F1(IO_L9N_T1_DQS_34)
FPGA_HDMI_TD1+: L4.4 R74.2 R86.2 U1.E2(IO_L10P_T1_34)
FPGA_HDMI_TD1-: L4.3 R75.2 R87.2 U1.D2(IO_L10N_T1_34)
FPGA_HDMI_TD2+: L3.4 R72.2 R80.2 U1.D1(IO_L11P_T1_SRCC_34)
FPGA_HDMI_TD2-: L3.3 R73.2 R81.2 U1.C1(IO_L11N_T1_SRCC_34)
FPGA_INTB: R25.2 R54.2 U1.P8(INIT_B_0)
FPGA_INTB_ESP: R25.1 U2.15(GPIO26)
FPGA_IO0: J10.1 U1.N14(IO_L21P_T3_DQS_14)
FPGA_IO1: J10.2 U1.M14(IO_L21N_T3_DQS_D22_14)
FPGA_IO2: J10.3 U1.C4(IO_L6N_T0_VREF_34)
FPGA_IO3: J10.4 U1.B13(IO_L5P_T0_D06_14)
FPGA_IO4: J10.5 U1.N10(IO_L23P_T3_D19_14)
FPGA_IO5: J10.6 U1.M10(IO_25_14)
FPGA_IO6: J10.7 U1.B14(IO_L5N_T0_D07_14)
FPGA_IO7: J10.8 U1.D3(IO_L1P_T0_34)
FPGA_IO8: J10.9 U1.P5(IO_L24P_T3_34)
FPGA_IO9: J10.10 U1.E11(IO_0_14)
FPGA_IO10: BUTTON1.1(A0) BUTTON1.2(A1) C96.1 R102.2 U1.C3(IO_L1N_T0_34)
FPGA_IO11: BUTTON2.1(A0) BUTTON2.2(A1) C98.1 R103.2 U1.M4(IO_L23N_T3_34)
FPGA_IO12: R128.2 U1.C10(IO_L2N_T0_D03_14)
FPGA_IO13: R129.2 U1.D10(IO_L2P_T0_D02_14)
FPGA_K1: R64.1 SW4.1 U1.M2(IO_L19N_T3_VREF_34)
FPGA_K2: R63.1 SW4.2 U1.L2(IO_L22N_T3_34)
FPGA_K3: R60.1 SW4.3 U1.L3(IO_L22P_T3_34)
FPGA_K4: R59.1 SW4.4 U1.K3(IO_L16N_T2_34)
FPGA_LED1: D18.+ U1.J1(IO_L15N_T2_DQS_34)
FPGA_LED2: D19.+ U1.A13(IO_L4N_T0_D05_14)
FPGA_M0: R57.2 U1.M7(M0_0)
FPGA_M1: R130.1 SW4.5 U1.M8(M1_0)
FPGA_M2: R56.2 U1.M9(M2_0)
FPGA_PROGRAM: R23.2 R53.2 U1.L7(PROGRAM_B_0)
FPGA_PROGRAM_ESP: R23.1 U2.14(GPIO25)
FPGA_QSPI_CLK: R84.1 U1.H14(IO_L14N_T2_SRCC_14)
FPGA_QSPI_CS: R115.1 U1.M13(IO_L15P_T2_DQS_RDWR_B_14)
FPGA_QSPI_D: R141.1 U1.P2(IO_L20P_T3_34)
FPGA_QSPI_HD: R142.1 U1.D13(IO_L8N_T1_D12_14)
FPGA_QSPI_Q: R140.1 U1.L14(IO_L15N_T2_DQS_DOUT_CSO_B_14)
FPGA_QSPI_WP: R143.1 U1.J13(IO_L18P_T2_D28_14)
FPGA_RGB: LED1.3(DIN) U1.N11(IO_L23N_T3_D18_14)
FPGA_RST: C95.1 FPGA_RST.1(A0) FPGA_RST.2(A1) R101.2 U1.D14(IO_L11P_T1_SRCC_14)
FPGA_TCK: J8.4 U1.A7(TCK_0)
FPGA_TDI: J8.6 U1.P7(TDI_0)
FPGA_TDO: J8.5 U1.P6(TDO_0)
FPGA_TMS: J8.3 U1.M6(TMS_0)
GND: ANT1.2(GND1) ANT1.3(GND2) BOOT.3(B0) BOOT.4(B1) BUTTON1.3(B0) BUTTON1.4(B1) BUTTON2.3(B0) BUTTON2.4(B1) C1.1 C2.1 C3.1 C4.2 C5.2 C6.2 C7.2 C8.2 C9.2 C10.2 C11.2 C12.2 C13.1 C14.1 C15.1 C16.1 C17.1 C18.1 C21.2 C22.2 C23.2 C24.2 C25.2 C26.2 C27.2 C28.2 C29.2 C30.2 C31.2 C32.2 C33.2 C34.2 C35.2 C36.2 C37.2 C38.2 C39.2 C40.2 C41.2 C42.2 C43.2 C44.2 C45.2 C46.2 C47.1 C48.1 C49.1 C50.2 C51.2 C52.1 C54.1 C55.1 C56.1 C57.1 C58.1 C59.2 C60.2 C61.1 C62.1 C63.2 C64.2 C65.2 C66.2 C67.2 C68.2 C69.1 C70.1 C71.2 C72.2 C73.2 C74.1 C75.2 C76.1 C77.1 C78.2 C79.2 C80.2 C81.2 C82.1 C83.2 C84.2 C85.1 C86.2 C87.2 C91.1 C92.1 C94.1 C95.2 C96.2 C97.1 C98.2 C99.2 C100.2 C101.1 C102.2 C103.1 C104.2 C105.2 C106.1 D1.1 D2.1 D3.- D5.1 D6.1 D7.1 D8.1 D9.1 D11.1 D12.1 D13.1 D14.1 D15.1 D16.1 D17.1 D21.2 FB7.1 FB8.2 FB9.2 FPGA_RST.3(B0) FPGA_RST.4(B1) J1.2 J1.3 J2.4 J3.6(VSS) J3.9(GND) J4.4 J5.4 J6.1 J6.4 J6.7 J6.10 J6.16 J6.19 J6.22 J6.25 J8.2 J9.1(TMDS_DATA2_SHIELD) J9.4(TMDS_DATA1_SHIELD) J9.7(TMDS_DATA0_SHIELD) J9.10(TMDS_CLOCK_SHIELD) J9.13(DDC/CEC_GROUND) L1.1 L2.1 LED1.2(VSS) LED2.2(VSS) Q1.2(S) R6.1 R7.2 R11.2 R15.2 R19.1 R20.1 R22.2 R33.2 R35.2 R38.2 R44.1 R45.1 R46.1 R59.2 R60.2 R63.2 R64.2 R65.2 R67.1 R71.1 R118.2 R120.2 R122.2 R124.2 R126.1 R130.2 R133.2 R145.1 R149.1 R153.2 R155.2 R157.2 R159.2 R161.2 R163.2 R165.2 R167.2 R173.2 R175.2 R177.2 R179.2 R184.1 R185.1 RST.3(B0) RST.4(B1) SW2.2(GND) U1.A1(GND) U1.A6(GND) U1.A9(GND) U1.A11(GND) U1.A14(GND) U1.B4(GND) U1.B7(GND) U1.B8(NC) U1.B9(GND) U1.C2(GND) U1.C6(GND) U1.C7(GND) U1.C8(GND) U1.C9(GND) U1.C13(GND) U1.D5(GND) U1.D7(GND) U1.D9(GND) U1.D11(GND) U1.E1(GND) U1.E3(GND) U1.E6(GND) U1.E8(GND) U1.E10(GND) U1.E14(GND) U1.F5(GND) U1.F7(NC) U1.F9(GND) U1.G3(GND) U1.G6(GND) U1.G7(NC) U1.G8(NC) U1.G10(GND) U1.G12(GND) U1.H5(GND) U1.H7(NC) U1.H8(NC) U1.H9(GND) U1.J6(GND) U1.J7(DXN_0) U1.J8(DXP_0) U1.J10(GND) U1.K1(GND) U1.K5(GND) U1.K7(GND) U1.K9(GND) U1.K14(GND) U1.L4(GND) U1.L6(GND) U1.L8(GND) U1.L10(GND) U1.L11(GND) U1.N3(GND) U1.N5(GND) U1.N9(GND) U1.N12(GND) U1.P1(GND) U1.P14(GND) U2.PAD(GND) U3.4(GND) U4.2(DVSS) U4.23(VRB) U4.24(DVSS) U5.3(GND) U5.PAD U7.1(GND) U8.2(VSS) U9.2(VSS) U10.15(GND) U10.26(GND) U10.27(GND) U11.7(FSW) U11.8(DEF) U11.15(PGND) U11.16(PGND) U11.PAD U12.2(SDX) U12.3(SCX) U12.6(GND) U12.7(GND) U13.1(GND) U15.3 U15.8 U16.3 U16.8 U17.7(GND) U18.7(GND) USB2.A1_B12(A1/B12/GND) USB2.B1_A12(B1/A12/GND) X2.2(GND) X3.2(GND) X3.4(GND) ; supply symbol labelled GND_POWER
GPIO0: BOOT.1(A0) BOOT.2(A1) Q5.3(C) R4.1 U2.23(GPIO0)
HDMI_5V: C18.2 C94.2 D4.- D6.2 J9.18(+5V_POWER) R39.1 R40.1 R41.1
HDMI_CEC: D9.2 J9.14(CEC) R93.2 U1.E4(IO_L7P_T1_34)
HDMI_DDCSCL: D8.2 J9.15(SCL) R40.2 U13.6(SCL2)
HDMI_DDCSDA: D7.2 J9.16(SDA) R41.2 U13.5(SDA2)
HDMI_HPD: D5.2 J9.19(HOT_PLUG_DETECT) R67.2 R70.1
HDMI_HPD_DET: Q1.3(D) R21.1 U1.D4(IO_L7N_T1_34)
HDMI_TCK+: J9.11(TMDS_CLOCK+) L7.1 R90.1 U16.4 U16.7
HDMI_TCK-: J9.12(TMDS_CLOCK-) L7.2 R91.1 U16.5 U16.6
HDMI_TD0+: J9.8(TMDS_DATA0+) L5.1 R88.1 U16.1 U16.10
HDMI_TD0-: J9.9(TMDS_DATA0-) L5.2 R89.1 U16.2 U16.9
HDMI_TD1+: J9.5(TMDS_DATA1+) L4.1 R86.1 U15.4 U15.7
HDMI_TD1-: J9.6(TMDS_DATA1-) L4.2 R87.1 U15.5 U15.6
HDMI_TD2+: J9.2(TMDS_DATA2+) L3.1 R80.1 U15.1 U15.10
HDMI_TD2-: J9.3(TMDS_DATA2-) L3.2 R81.1 U15.2 U15.9
IMU_AD: R114.1 U1.J14(IO_L18N_T2_D27_14) U12.1(SDO/SA0)
IMU_INT2: U1.L12(IO_L16P_T2_CSI_B_14) U12.9(INT2)
N$1: Q2.3(D) Q3.3(D)
N$2: C2.2 R47.2 X3.3(X2)
N$3: R22.1 USB2.A5(A5/CC1)
N$4: R16.1 X2.3(OUT)
N$5: R15.1 USB2.B5(B5/CC2)
N$6: R117.1 U12.12(CS)
N$7: C12.1 J6.15 J6.30 R37.1
N$8: R10.2 U5.26(TXD)
N$9: D10.- R93.1
N$10: C20.2 R1.2 U2.47(CAP2)
N$11: C20.1 C21.1 R1.1 U2.48(CAP1)
N$12: L1.2 R58.2 U2.2(LNA_IN)
N$13: ANT1.1(D) L2.2 R58.1
N$14: C24.1 R2.1 R3.1 U3.8(VCC)
N$15: L15.1 U5.5(D-)
N$16: C26.1 FB2.2 U4.14(AVDD) U4.15(AVDD) U4.18(AVDD)
N$17: L15.4 U5.4(D+)
N$18: Q5.1(B) R14.1
N$19: C13.2 R8.1 U5.9(!RST)
N$20: C83.1 R12.2 U5.25(RXD)
N$21: C29.1 FB3.1 U6.4(AVDD/VREF)
N$22: R50.1 R149.2 X2.1(ENABLE)
N$23: Q4.2(E) R14.2 U5.24(RTS)
N$24: Q5.2(E) R9.2 U5.28(DTR)
N$25: Q4.1(B) R9.1
N$26: R7.1 U6.5(GND)
N$27: D11.2 J3.10(CD) R85.1 R107.2
N$28: D3.+ R13.2
N$29: FB6.2 SW1.CH1A SW1.CH2A
N$30: R51.2 SW4.7
N$31: D4.+ F2.1
N$32: Q1.1(G) R70.2
N$33: D12.2 J3.1(DAT2) R94.1 R108.2
N$34: R6.2 U4.20(AVSS) U4.21(AVSS)
N$35: D13.2 J3.2(DAT3/CD) R95.1 R109.2
N$36: D14.2 J3.3(CMD) R96.1 R110.2
N$37: R39.2 U13.7(VREF2) U13.8(EN)
N$38: R52.2 SW4.8
N$39: R83.2 SW4.9
N$40: C79.1 D15.2 J3.5(CLK) R97.1 R111.2
N$41: R92.2 SW4.10
N$42: R82.2 SW4.6
N$44: D16.2 J3.7(DAT0) R105.1 R112.2
N$46: D20.- R46.2
N$47: FB7.2 J9.P2(SHELL2) J9.P3(SHELL3)
N$48: FB8.1 USB2.S1 USB2.S2 USB2.S5(S1) USB2.S6(S2)
N$49: FB9.1 J3.13(GND) J3.14(GND)
N$50: D18.- R44.2
N$51: D19.- R45.2
N$53: D17.2 J3.8(DAT1) R106.1 R113.2
N$60: C81.1 C82.2 FB4.2 J3.4(VDD) R85.2 R94.2 R95.2 R96.2 R97.2 R105.2 R106.2
N$65: R65.1 U1.B10(IO_L3P_T0_DQS_PUDC_B_14)
N$69: LED1.1(DOUT) LED2.3(DIN)
N$74: C91.2 C92.2 LED1.4(VDD) LED2.4(VDD) R66.2
N$80: R62.2 U11.13(EN)
N$85: C53.2 U11.9(SS/TR)
N$106: C74.2 C76.2 C77.2 FB6.1 L6.2 R134.1 U11.14(VOS)
N$108: L6.1 R61.2 U11.1(SW) U11.2(SW) U11.3(SW)
N$111: R61.1 U11.4(PG)
N$113: R134.2 R135.1 U11.5(FB)
SDCARD_CCLK: C80.1 R111.1 U2.17(MTMS)
SDCARD_CD: R107.1 U2.25(GPIO16)
SDCARD_CMD: R110.1 U2.21(MTDO)
SDCARD_D0: R112.1 U2.22(GPIO2)
SDCARD_D1: R113.1 U2.24(GPIO4)
SDCARD_D2: R108.1 U2.18(MTDI)
SDCARD_D3: R109.1 U2.20(MTCK)
SYSCLK: C71.1 R16.2 U1.H4(IO_L13P_T2_MRCC_34)
U0RXD: C100.1 R10.1 U2.40(U0RXD)
U0TXD: R12.1 U2.41(U0TXD)
USB5V: D21.1 F1.2 USB2.A4_B9(A4/B9/VBUS) USB2.B4_A9(B4/A9/VBUS)
VCC_1V: C31.1 C32.1 C33.1 C34.1 C35.1 C36.1 C37.1 C38.1 C39.1 C41.1 C45.1 C46.1 C52.2 C58.2 C59.1 C60.1 U1.D6(VCCINT) U1.D8(VCCINT) U1.E5(VCCBRAM) U1.E7(VCCINT) U1.E9(VCCINT) U1.F6(VCCINT) U1.G5(VCCBRAM) U1.G9(VCCINT) U1.H6(VCCINT) U1.J5(VCCBRAM) U1.J9(VCCINT) U1.K6(VCCINT) U1.K8(VCCINT) U8.5(VOUT)
VCC_1V8: C40.1 C42.1 C43.1 C44.1 C61.2 C62.2 C63.1 C64.1 U1.F8(NC) U1.F10(VCCAUX) U1.H10(VCCAUX) U1.K10(VCCAUX) U1.L9(VCCAUX) U9.5(VOUT)
VCC_3V3: C25.1 C27.1 C28.1 C30.1 C48.2 C49.2 C50.1 C51.1 C72.1 C73.1 C75.1 C78.1 C85.2 C90.2 C105.1 C106.2 D10.+ FB1.2 FB2.1 FB3.2 FB4.1 FB5.1 J2.3 J4.3 J8.1 Q2.2(S) R17.2 R18.2 R21.2 R30.2 R31.2 R37.2 R42.1 R43.1 R48.2 R50.2 R51.1 R52.1 R53.1 R54.1 R55.1 R56.1 R57.1 R66.1 R72.1 R73.1 R74.1 R75.1 R76.1 R77.1 R78.1 R79.1 R82.1 R83.1 R92.1 R101.1 R102.1 R103.1 R144.2 R147.2 R148.1 R180.2 R181.2 R182.2 R183.1 R186.2 U1.G2(VCCO_34) U1.G13(VCCO_14) U1.K2(VCCO_34) U1.K13(VCCO_14) U1.N2(VCCO_34) U1.N6(VCCO_0) U1.N7(CFGBVS_0) U1.N8(VCCO_0) U1.N13(VCCO_14) U4.11(DVDD) U4.13(DVDD) U4.17(VRT) U7.2(OUT) U7.TER(OUT) U13.2(VREF1) U17.1(VCCA) U18.1(VCCA) X2.4(VDD)
VCC_3V3_AR: Q3.2(S) R49.1 R148.2 U10.29(3V3)
VCC_5V: C10.1 C11.1 C65.1 C66.1 C67.1 C68.1 C69.2 C70.2 C90.1 C93.1 C101.2 C102.1 C103.2 C104.1 F2.2 J15.1 R13.1 R146.2 R150.2 R151.2 R171.2 R187.1 SW1.COM1 SW1.COM2 SW2.10(V+) U7.3(IN) U8.1(VIN) U8.3(CE) U9.1(VIN) U9.3(CE) U17.14(VCCB) U18.14(VCCB)
VCC_5V_AR: J5.6 J15.2 U10.28(5V)
VCC_ESP: C4.1 C5.1 C6.1 C7.1 C8.1 C9.1 C22.1 C23.1 FB1.1 R3.2 R4.2 R5.2 R104.1 R116.1 R125.2 R127.1 U2.1(VDDA) U2.3(VDD3P3) U2.4(VDD3P3) U2.19(VDD3P3_RTC) U2.37(VDD3P3_CPU) U2.43(VDDA) U2.46(VDDA)
VDD: C16.2 C17.2 R8.2 U5.6(VDD) ; supply symbol labelled POWER_BAR
VERSION_1: R18.1 R20.2 U1.P4(IO_L21P_T3_DQS_34)
VERSION_2: R17.1 R19.2 U1.P3(IO_L21N_T3_DQS_34)
VERSION_3: R145.2 R147.1 U1.C14(IO_L11N_T1_SRCC_14)
VIN: C47.2 C54.2 C55.2 C56.2 C57.2 C93.2 R62.1 TP5.T U10.25(VIN) U11.10(AVIN) U11.11(PVIN) U11.12(PVIN)
VUSB: C1.2 C14.2 C15.2 F1.1 SW1.CH1B SW1.CH2B U5.7(REGIN) U5.8(VBUS)
XTAL_N: R47.1 U2.44(XTAL_N)
XTAL_P: C3.2 U2.45(XTAL_P) X3.1(X1)
Unconnected: J3.11(GND) J3.12(GND) J3.15(GND) J3.16(GND) J9.17(UTILITY) J9.P1(SHELL1) J9.P4(SHELL4) J15.3 LED2.1(DOUT) SW2.3(NO3) SW2.4(COM3) SW2.5(NC3) SW2.6(IN3_4) SW2.7(NO4) SW2.8(COM4) SW2.9(NC4) U4.16(VRTS) U4.22(VRBS) U5.1(DCD) U5.2(RI) U5.10(NC) U5.11(!SUSPEND) U5.12(SUSPEND) U5.13(NC) U5.14(NC) U5.15(NC) U5.16(NC) U5.17(NC) U5.18(VPP) U5.19(NC) U5.20(NC) U5.21(NC) U5.22(NC) U5.23(CTS) U5.27(DSR) U8.4(NC) U9.4(NC) U10.16(AREF) U10.31(ADC7) U10.32(ADC6) U12.4(INT1) U12.10(OCS) U12.11(NC) U17.6(NC) U17.9(NC) U18.6(NC) U18.9(NC) USB2.A8(A8/SBU1) USB2.B8(B8/SBU2) USB2.S3 USB2.S4

## Notes on the sheet
- DAC | ADC | LED
- USB_Type C | Arduino Interface
- POWER
- Digital D2 | I2C
- Arduino SPI
- Layout Notes:
- Layout Notes:
- Close to Grove Interface
- v1.0 | Initial Version | 2019.08.08 | weifeng.zeng | Place R10 C100 Close to CP2102
- Place R12 C83 Close to ESP32
- Mini HDMI
- Layout Notes:
- M[2~0]=101 JTAG Mode | ESP32-D0WDQ6 | Differential impedance:100 Ohm
- M[2~0]=111 Slave serial Mode
- Slave serial mode only supports .bin format document
- Arduino Analog Pins:
- FPGA_Download--Interface(2) | A0~A5
- Arduino Digital Pins:
- D2~D13
- If the board is used as a main board，you can enable the Q2 and Q3
- If the board is used as a shield board，you should disable the Q2 and Q3
- Vout(5.09)=0.8*((536/100)+1)
- changed the package
- Layout Notes:
- In order to distinguish hardware version
- ESP32_FPGA--Flash
- Sample version：000
- ESD Protection Diodes 
  close to HDMI Connector.
- If you want to power to Arduino board,
- Official version： 001 | Layout Notes: | you can use a jumper cap to connect (ON)
- Arduino I2C Uart SPI Pins:
- Layout Notes:
- ESD Protection Diodes 
  close to HDMI Connector.
- Place C79 R111 C80 Close to FPGA
- ESP32_FPGA--Program
- In order to distinguish FPGA type
- Pull_Down --- XC7S15
- Layout Notes:
- MIPI CAMERA
- Pull_UP --- XC7S25
- Differential impedance:100 Ohm
- ESP32_FPGA--QSPI
- Analog Switch
- 6-Axis
- Accelerometer and Gyroscope
- FPGA_Crystal
- Address Choose
- weifeng.zeng | weifeng.zeng | weifeng.zeng | weifeng.zeng
- weifeng.zeng | weifeng.zeng
- v1.0 | v1.0 | v1.0 | v1.0
- v1.0 | v1.0

## Library data of the parts
ANT1 = Connector-new:ANTENNA-ACD5036; MPN: ACD-5036-A3-CC-S
BOOT BUTTON1 BUTTON2 FPGA_RST RST = Switch:BUTTON-4P
C1-C18 C20-C87 C90-C106 = Discrete-new:CAP: Ceramic Capacitors
D1 D2 D5-D9 D11-D17 D21 = Discrete-new:D-ESD-2P-DOUBLE
D3 D18-D20 = Discrete-new:LED
D4 D10 = Discrete-new:DIODE
F1 F2 = Discrete-new:FUSE
FB1-FB9 = Discrete-new:FERRITE-BEAD
FR1-FR6 = moudle-new:SEEEDSTUDIO-OPEN-SCH-FRAME-BIG
J1 = Connector-new:HEADER-4P
J2 J4 = Connector-new:GROVE-CONNECTOR-DIP
J3 = Connector-new:MICRO-SD-CARD-HOLDER-9P-SCHA5B0200: 320090010
J5 = Connector-new:HEADER-2X3P
J6 = Connector-new:HEADER-2X15P-SMD
J8 = Connector-new:HEADER-6P
J9 = Connector-new:MINI-HDMI-19PIN-SMT-C-TYPE
J10 = Connector-new:HEADER-10P
J15 = Connector-new:HEADER-3P
L1 L2 L6 = Discrete-new:INDUCTOR
L3-L5 L7 L15 = Discrete-new:INDUCTOR-COMMON-MODE
LED1 LED2 = Discrete-new:LED-SK6805-2427
Q1 = Discrete-new:MOSFET-N: IRLL014: http://www.vishay.com/docs/91319/sihll014.pdf
Q2 Q3 = Discrete-new:MOSFET-P
Q4 Q5 = Discrete-new:TRANSISTOR-NPN: NPN audion
R1-R130 R133-R135 R140-R167 R171-R187 = Discrete-new:RES
SW1 = Switch:SWITCH-2CH-6P
SW2 = IC-new:SWITCH-DG2788A
SW4 = Switch:SWITCH-5BIT
TP1 TP2 = Discrete-new:TEST-POINT
TP5 = Discrete-new:TEST-POINT; PARTNO: DNP
U1 = xilinx:XC7S15
U2 = IC-new:MCU-ESP32-DD0WDQ6
U3 = IC-new:FLASH-W25X80: 1M-BIT,2M-BIT,4M-BIT AND 8M-BIT SERIAL FLASH MEMORY WITH 4KB SECTORS AND DUAL OUTPUT SPI
U4 = IC-new:CONVERTER-ADC1173
U5 = template:TRANSFER_CP2102_9
U6 = IC-new:CONVERTER-DAC7311
U7 = IC-new:PMIC-CJ*1117: Low Drop Fixed And Adjustable Positive Voltage Regulators http://www.datasheetcatalog.org/datasheet/SGSThomsonMicroelectronics/mXuqtqv.pdf
U8 U9 = IC-new:PMIC-LDO-XC6210
U10 = moudle-new:ARDUINO-32P
U11 = IC-new:PMIC-TPS62140
U12 = Sensor:SENSOR-LSM6DS3; PROD_ID: IC-12969
U13 = IC-new:TRANSLATOR-PCA9306DQER
U15 U16 = Discrete-new:ESD-RCLAMP0524P
U17 U18 = IC-new:TRANSLATOR-TXS0104E
USB2 = Connector-new:USB2.0-TYPE-C
X2 = Discrete-new:CRYSTAL-OSCILLATOR
X3 = Discrete-new:CRYSTAL-4P